# Altium project CHIP_PRO_v1_0.PrjPcb
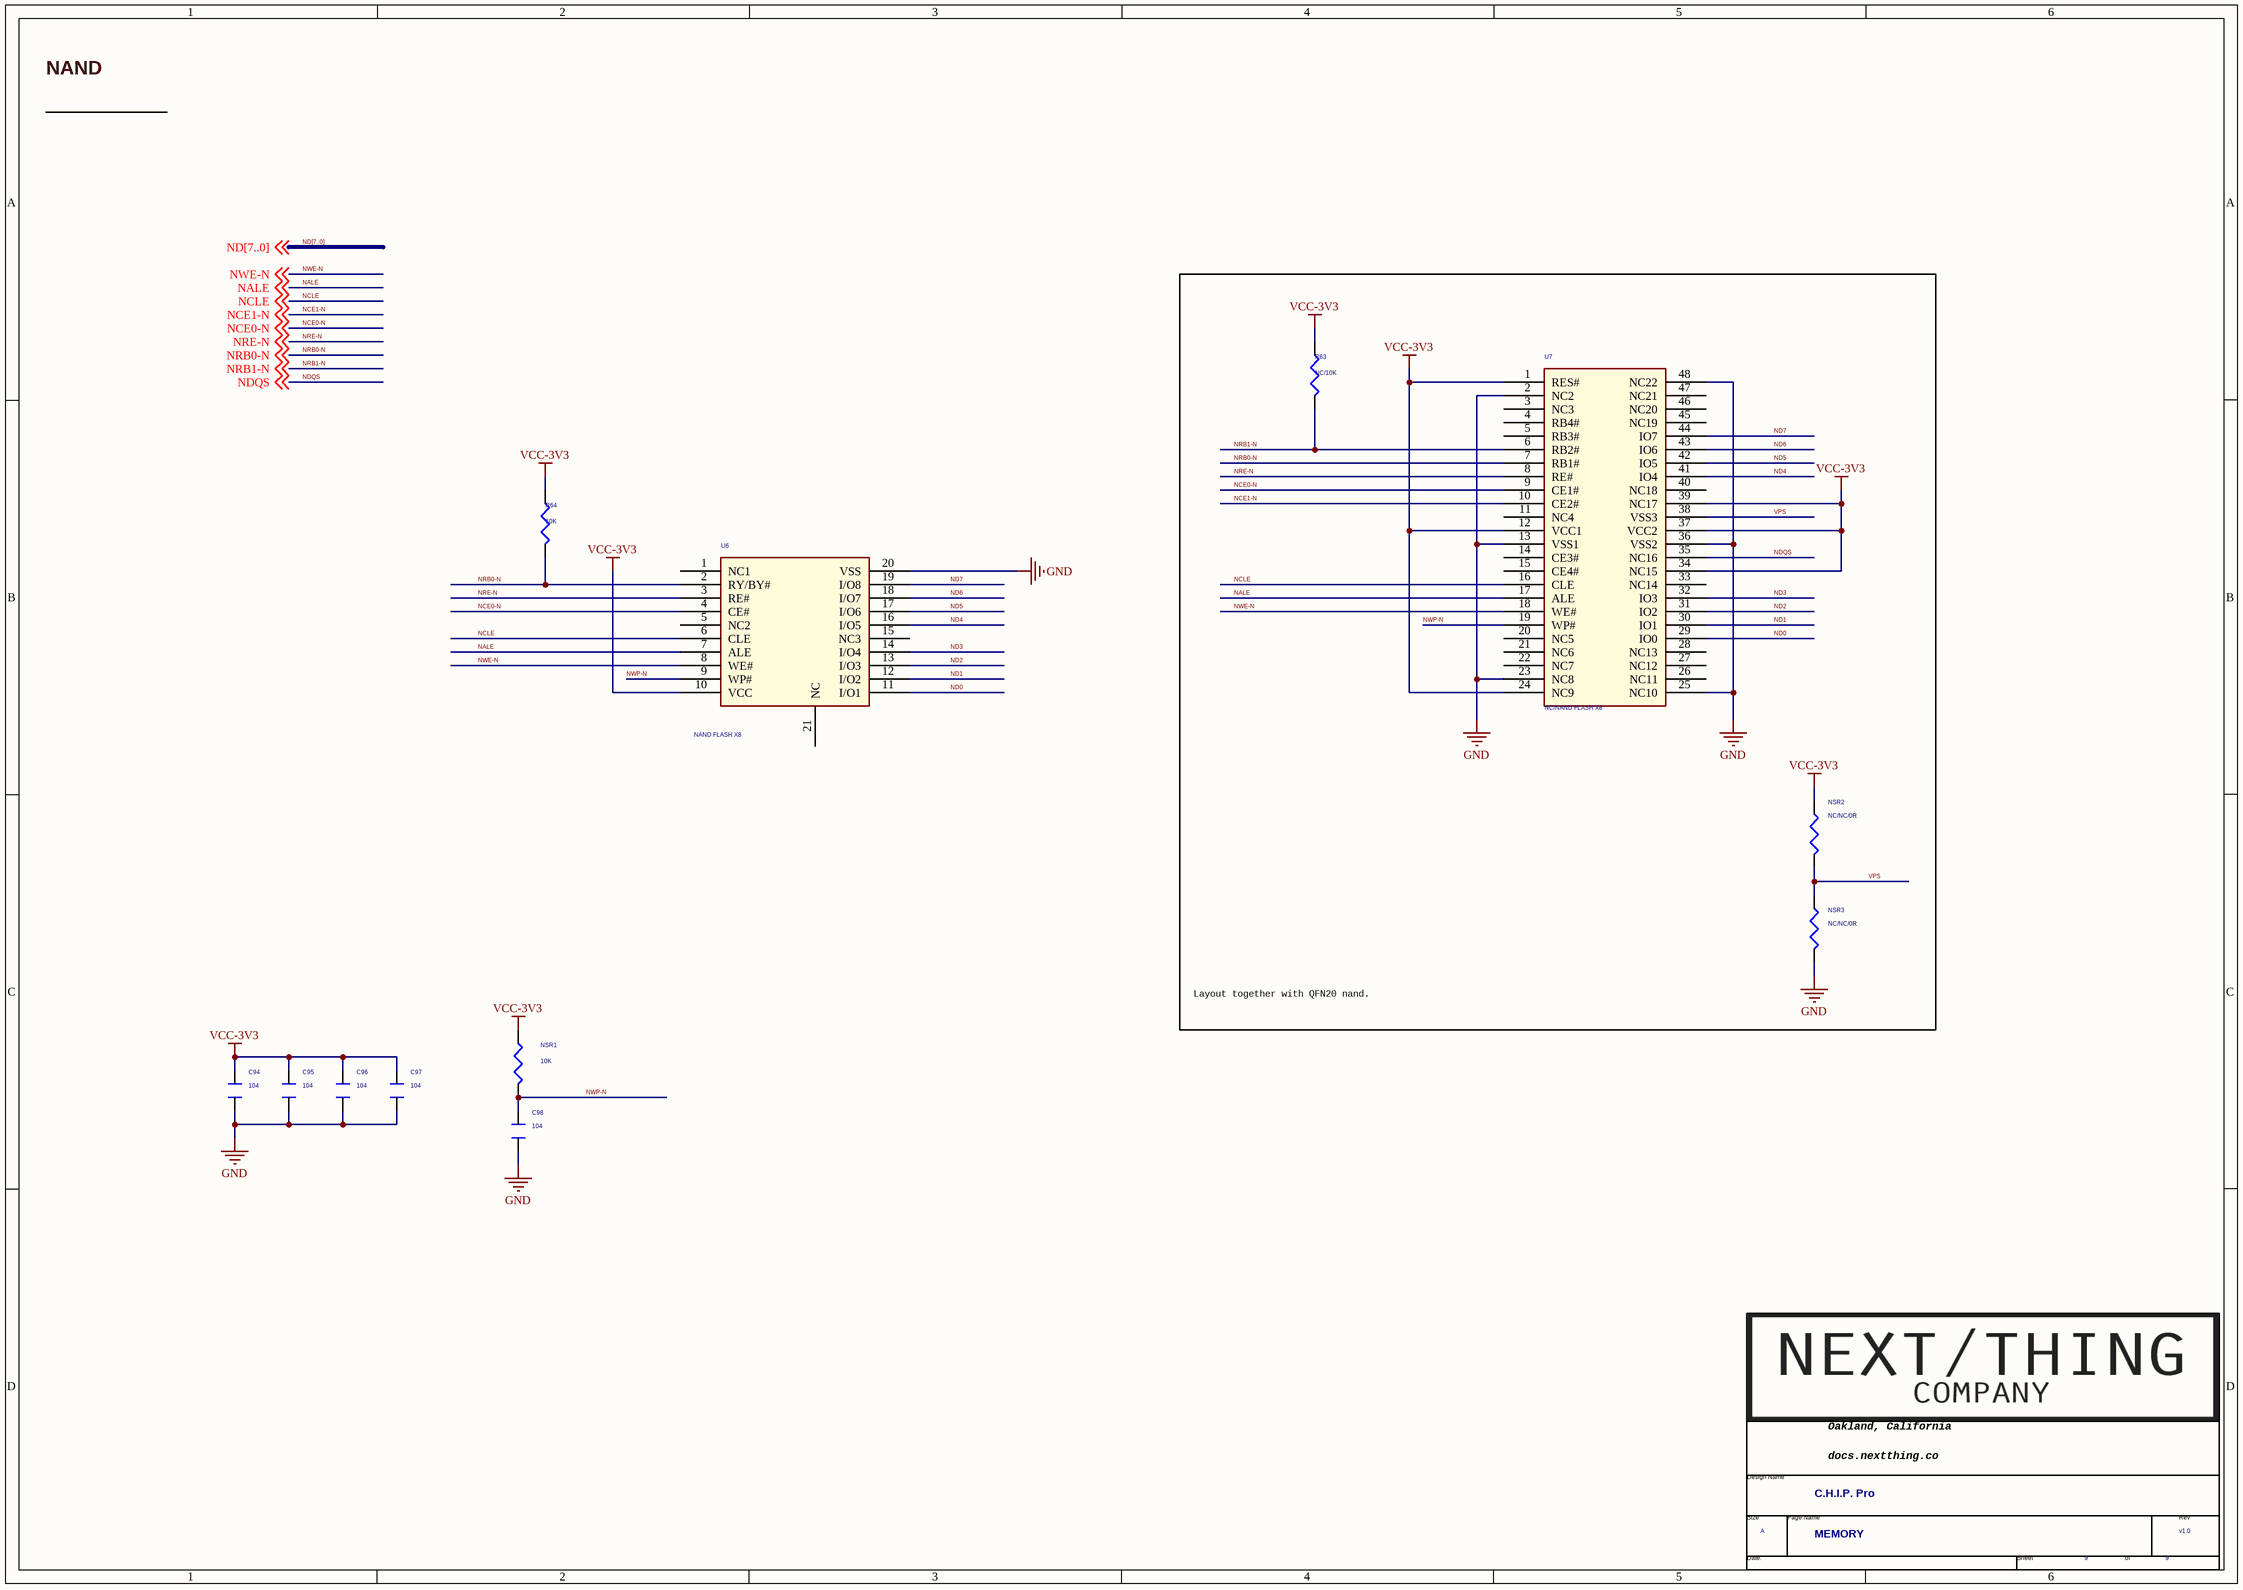
[diagram p0: 09 NAND.SchDoc]
9 sheets, 202 parts. Net scope: global (net labels, ports and power ports of the same name join across sheets).
Sheets:
  09 NAND.SchDoc
  08 BESIDE CPU.SchDoc
  07 USB.SchDoc
  06 SDIO WIFI&BT.SchDoc
  05 MISC.SchDoc
  04 POWER.SchDoc
  03 CPU.SchDoc
  02 BLOCK.SchDoc
  01 REVISION HISTORY.SchDoc

## Sheet 09 NAND.SchDoc
size 420 x 297 mm

### Parts
(Parts that share a designator on the sheet are numbered #1, #2 ... from top to bottom, then left to right.)
*#1  Page Count: 9  Page Size: A  Title: C.H.I.P. Pro  RevCode: v1.0  Doc: MEMORY  (hidden comment: TitleBlock1-nextthing)  (graphical)
C94  104  [C0201]
C95  104  [C0201]
C96  104  [C0201]
C97  104  [C0201]
C98  104  [C0201]
NSR1  10K  [R0201]
NSR2  NC/NC/0R  [R0201]
NSR3  NC/NC/0R  [R0201]
R63  NC/10K  [R0201]
R64  10K  [R0201]
U6  NAND FLASH X8  [TSOP-48]
U7  NC/NAND FLASH X8  [TSOP-48]

### Blocks framed on the sheet
Layout together with QFN20 nand.: NSR2 NSR3 R63 U7

### Nets
GND: C94.1 C95.1 C96.1 C97.1 C98.1 NSR3.2 U6.20(VSS) U7.2(NC2) U7.13(VSS1) U7.23(NC8) U7.25(NC10) U7.36(VSS2) U7.48(NC22)
VCC-3V3: C94.2 C95.2 C96.2 C97.2 NSR1.1 NSR2.1 R63.1 R64.1 U6.10(VCC) U7.1(RES#) U7.12(VCC1) U7.24(NC9) U7.34(NC15) U7.37(VCC2) U7.39(NC17)  [project net HPVCC]
NALE: U6.7(ALE) U7.17(ALE) ; off-sheet NALE
NCE0-N: U6.4(CE#) U7.9(CE1#) ; off-sheet NCE0-N
NCE1-N: U7.10(CE2#) ; off-sheet NCE1-N
NCLE: U6.6(CLE) U7.16(CLE) ; off-sheet NCLE
ND0: U6.11(I/O1) U7.29(IO0)
ND1: U6.12(I/O2) U7.30(IO1)
ND2: U6.13(I/O3) U7.31(IO2)
ND3: U6.14(I/O4) U7.32(IO3)
ND4: U6.16(I/O5) U7.41(IO4)
ND5: U6.17(I/O6) U7.42(IO5)
ND6: U6.18(I/O7) U7.43(IO6)
ND7: U6.19(I/O8) U7.44(IO7)
NDQS: U7.35(NC16) ; off-sheet NDQS
NRB0-N: R64.2 U6.2(RY/BY#) U7.7(RB1#) ; off-sheet NRB0-N
NRB1-N: R63.2 U7.6(RB2#) ; off-sheet NRB1-N
NRE-N: U6.3(RE#) U7.8(RE#) ; off-sheet NRE-N
NWE-N: U6.8(WE#) U7.18(WE#) ; off-sheet NWE-N
NWP-N: C98.2 NSR1.2 U6.9(WP#) U7.19(WP#)
VPS: NSR2.2 NSR3.1 U7.38(VSS3)

Not connected (* = marked no-connect by the designer): U6 1(NC1) 5(NC2) 15(NC3) 21(NC); U7 3(NC3) 4(RB4#) 5(RB3#) 11(NC4) 14(CE3#) 15(CE4#) 20(NC5) 21(NC6) 22(NC7) 26(NC11) 27(NC12) 28(NC13) 33(NC14) 40(NC18) 45(NC19) 46(NC20) 47(NC21)

### Buses and harness runs
bus ND[7..0]

### Notes on the sheet
- NAND
- (in symbol TitleBlock1-nextthing) Oakland, California; Design Name; docs.nextthing.co /; Size; Page Name; Rev; Date:; Sheet; of

### Library data of the parts
C94-C98 = CAPACITOR_0_Dup4: PAGE: 2
NSR1-NSR3 R63 R64 = R_Dup2
  R64: Value: 10K
U6 = NAND_QFN20_1
U7 = NAND_FLASH_X8
*#1 = TitleBlock1-nextthing: Page Number: 9; Page Create Date: March  8, 1995

## Sheet 08 BESIDE CPU.SchDoc
size 420 x 297 mm
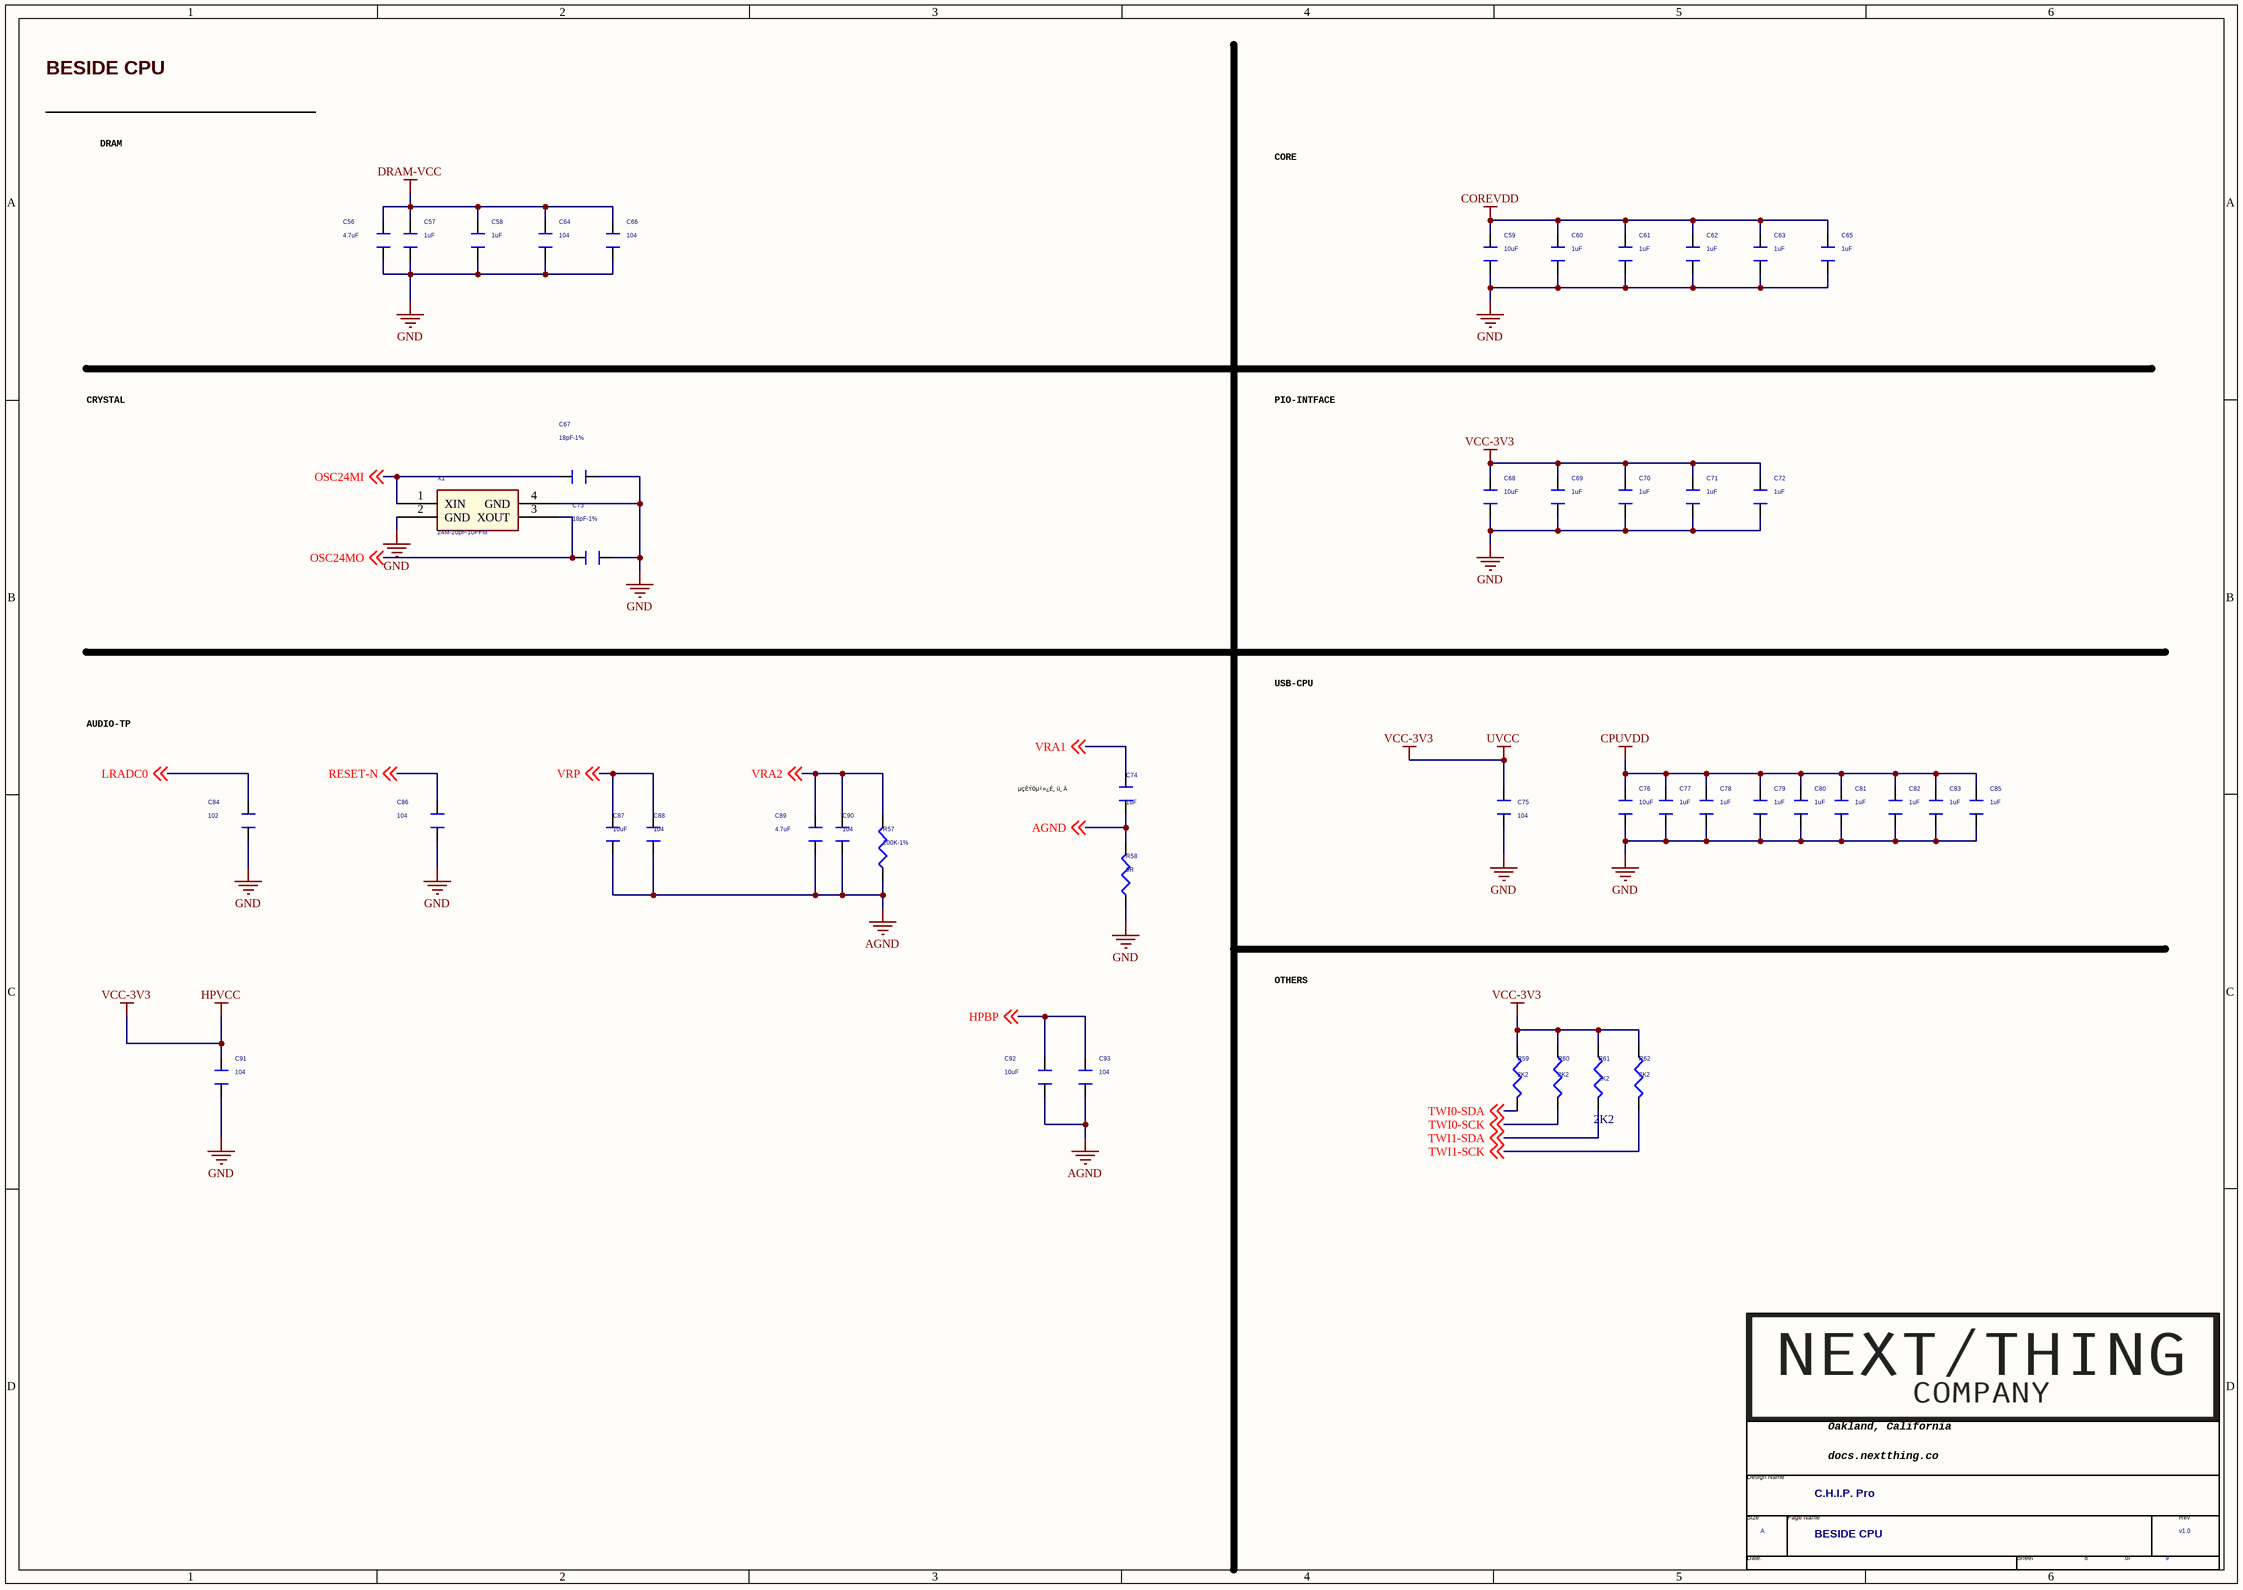
[diagram p1: 08 BESIDE CPU.SchDoc]

### Parts
(Parts that share a designator on the sheet are numbered #1, #2 ... from top to bottom, then left to right.)
*#2  Page Count: 9  Page Number: 8  Page Size: A  Title: C.H.I.P. Pro  RevCode: v1.0  Doc: BESIDE CPU  (hidden comment: TitleBlock1-nextthing)  (graphical)
C56  4.7uF  [C0603]
C57  1uF  [C0402]
C58  1uF  [C0402]
C59  10uF  [C0603]
C60  1uF  [C0402]
C61  1uF  [C0402]
C62  1uF  [C0402]
C63  1uF  [C0402]
C64  104  [C0201]
C65  1uF  [C0402]
C66  104  [C0201]
C67  18pF-1%  [C0201]
C68  10uF  [C0603]
C69  1uF  [C0402]
C70  1uF  [C0402]
C71  1uF  [C0402]
C72  1uF  [C0402]
C73  18pF-1%  [C0201]
C74  1uF  [C0402]
C75  104  [C0201]
C76  10uF  [C0603]
C77  1uF  [C0402]
C78  1uF  [C0402]
C79  1uF  [C0402]
C80  1uF  [C0402]
C81  1uF  [C0402]
C82  1uF  [C0402]
C83  1uF  [C0402]
C84  102  [C0201]
C85  1uF  [C0402]
C86  104  [C0201]
C87  10uF  [C0603]
C88  104  [C0201]
C89  4.7uF  [C0603]
C90  104  [C0201]
C91  104  [C0201]
C92  10uF  [C0603]
C93  104  [C0201]
R57  200K-1%  [R0201]
R58  0R  [R0201]
R59  2K2  [R0201]
R60  2K2  [R0201]
R61  2K2  [R0201]
R62  2K2  [R0201]
X1  24M-20pF-10PPM  [CRY-3225]

### Nets
AGND: C74.1 C87.1 C88.1 C89.1 C90.1 C92.1 C93.1 R57.1 R58.2 ; off-sheet AGND
COREVDD: C59.1 C60.1 C61.1 C62.1 C63.1 C65.1  [project net CORE-VDD]
CPUVDD: C76.1 C77.1 C78.1 C79.1 C80.1 C81.1 C82.1 C83.1 C85.1  [project net CPU-VDD]
DRAM-VCC: C56.2 C57.2 C58.2 C64.2 C66.2
GND: C56.1 C57.1 C58.1 C59.2 C60.2 C61.2 C62.2 C63.2 C64.1 C65.2 C66.1 C67.1 C68.2 C69.1 C70.1 C71.1 C72.1 C73.1 C75.1 C76.2 C77.2 C78.2 C79.2 C80.2 C81.2 C82.2 C83.2 C84.1 C85.2 C86.1 C91.1 R58.1 X1.2(GND) X1.4(GND)
HPVCC: C68.1 C69.2 C70.2 C71.2 C72.2 C75.2 C91.2 R59.1 R60.1 R61.1 R62.1  [also labelled UVCC, VCC-3V3]
HPBP: C92.2 C93.2 ; off-sheet HPBP
LRADC0: C84.2 ; off-sheet LRADC0
OSC24MI: C67.2 X1.1(XIN) ; off-sheet OSC24MI
OSC24MO: C73.2 X1.3(XOUT) ; off-sheet OSC24MO
RESET-N: C86.2 ; off-sheet RESET-N  [project net RESET]
TWI0-SCK: R60.2 ; off-sheet TWI0-SCK  [project net PB0]
TWI0-SDA: R59.2 ; off-sheet TWI0-SDA  [project net PB1]
TWI1-SCK: R62.2 ; off-sheet TWI1-SCK  [project net PB15]
TWI1-SDA: R61.2 ; off-sheet TWI1-SDA  [project net PB16]
VRA1: C74.2 ; off-sheet VRA1
VRA2: C89.2 C90.2 R57.2 ; off-sheet VRA2
VRP: C87.2 C88.2 ; off-sheet VRP

### Notes on the sheet
- BESIDE CPU
- DRAM
- CORE
- CRYSTAL
- PIO-INTFACE
- AUDIO-TP
- USB-CPU
- µçÈÝÖµ²»¿É¸ü¸Ä
- OTHERS
- (in symbol TitleBlock1-nextthing) Oakland, California; Design Name; docs.nextthing.co /; Size; Page Name; Rev; Date:; Sheet; of

### Library data of the parts
C56-C58 C64 C66 C67 C69-C73 C87 C92 C93 = CAPACITOR_0_Dup4: PAGE: 2
C59-C63 C65 C68 C76-C83 C85 = CAPACITOR_0_Dup3: PAGE: 1
C74 C84 C86 C88-C90 = CAPACITOR_0_Dup4
C75 C91 = CAPACITOR_0_Dup4: PAGE: 3
R57-R62 = R_Dup2
  R61: Value: 2K2
X1 = CRYSTAL-4_3: Crystal 24MHz 20pF 10ppm  -30 to +85; PART NUMBER: 7M24000004; Vendor: TXC; SPREADWIN PN: U3000019A
*#2 = TitleBlock1-nextthing: Page Create Date: March  8, 1995

## Sheet 07 USB.SchDoc
size 420 x 297 mm
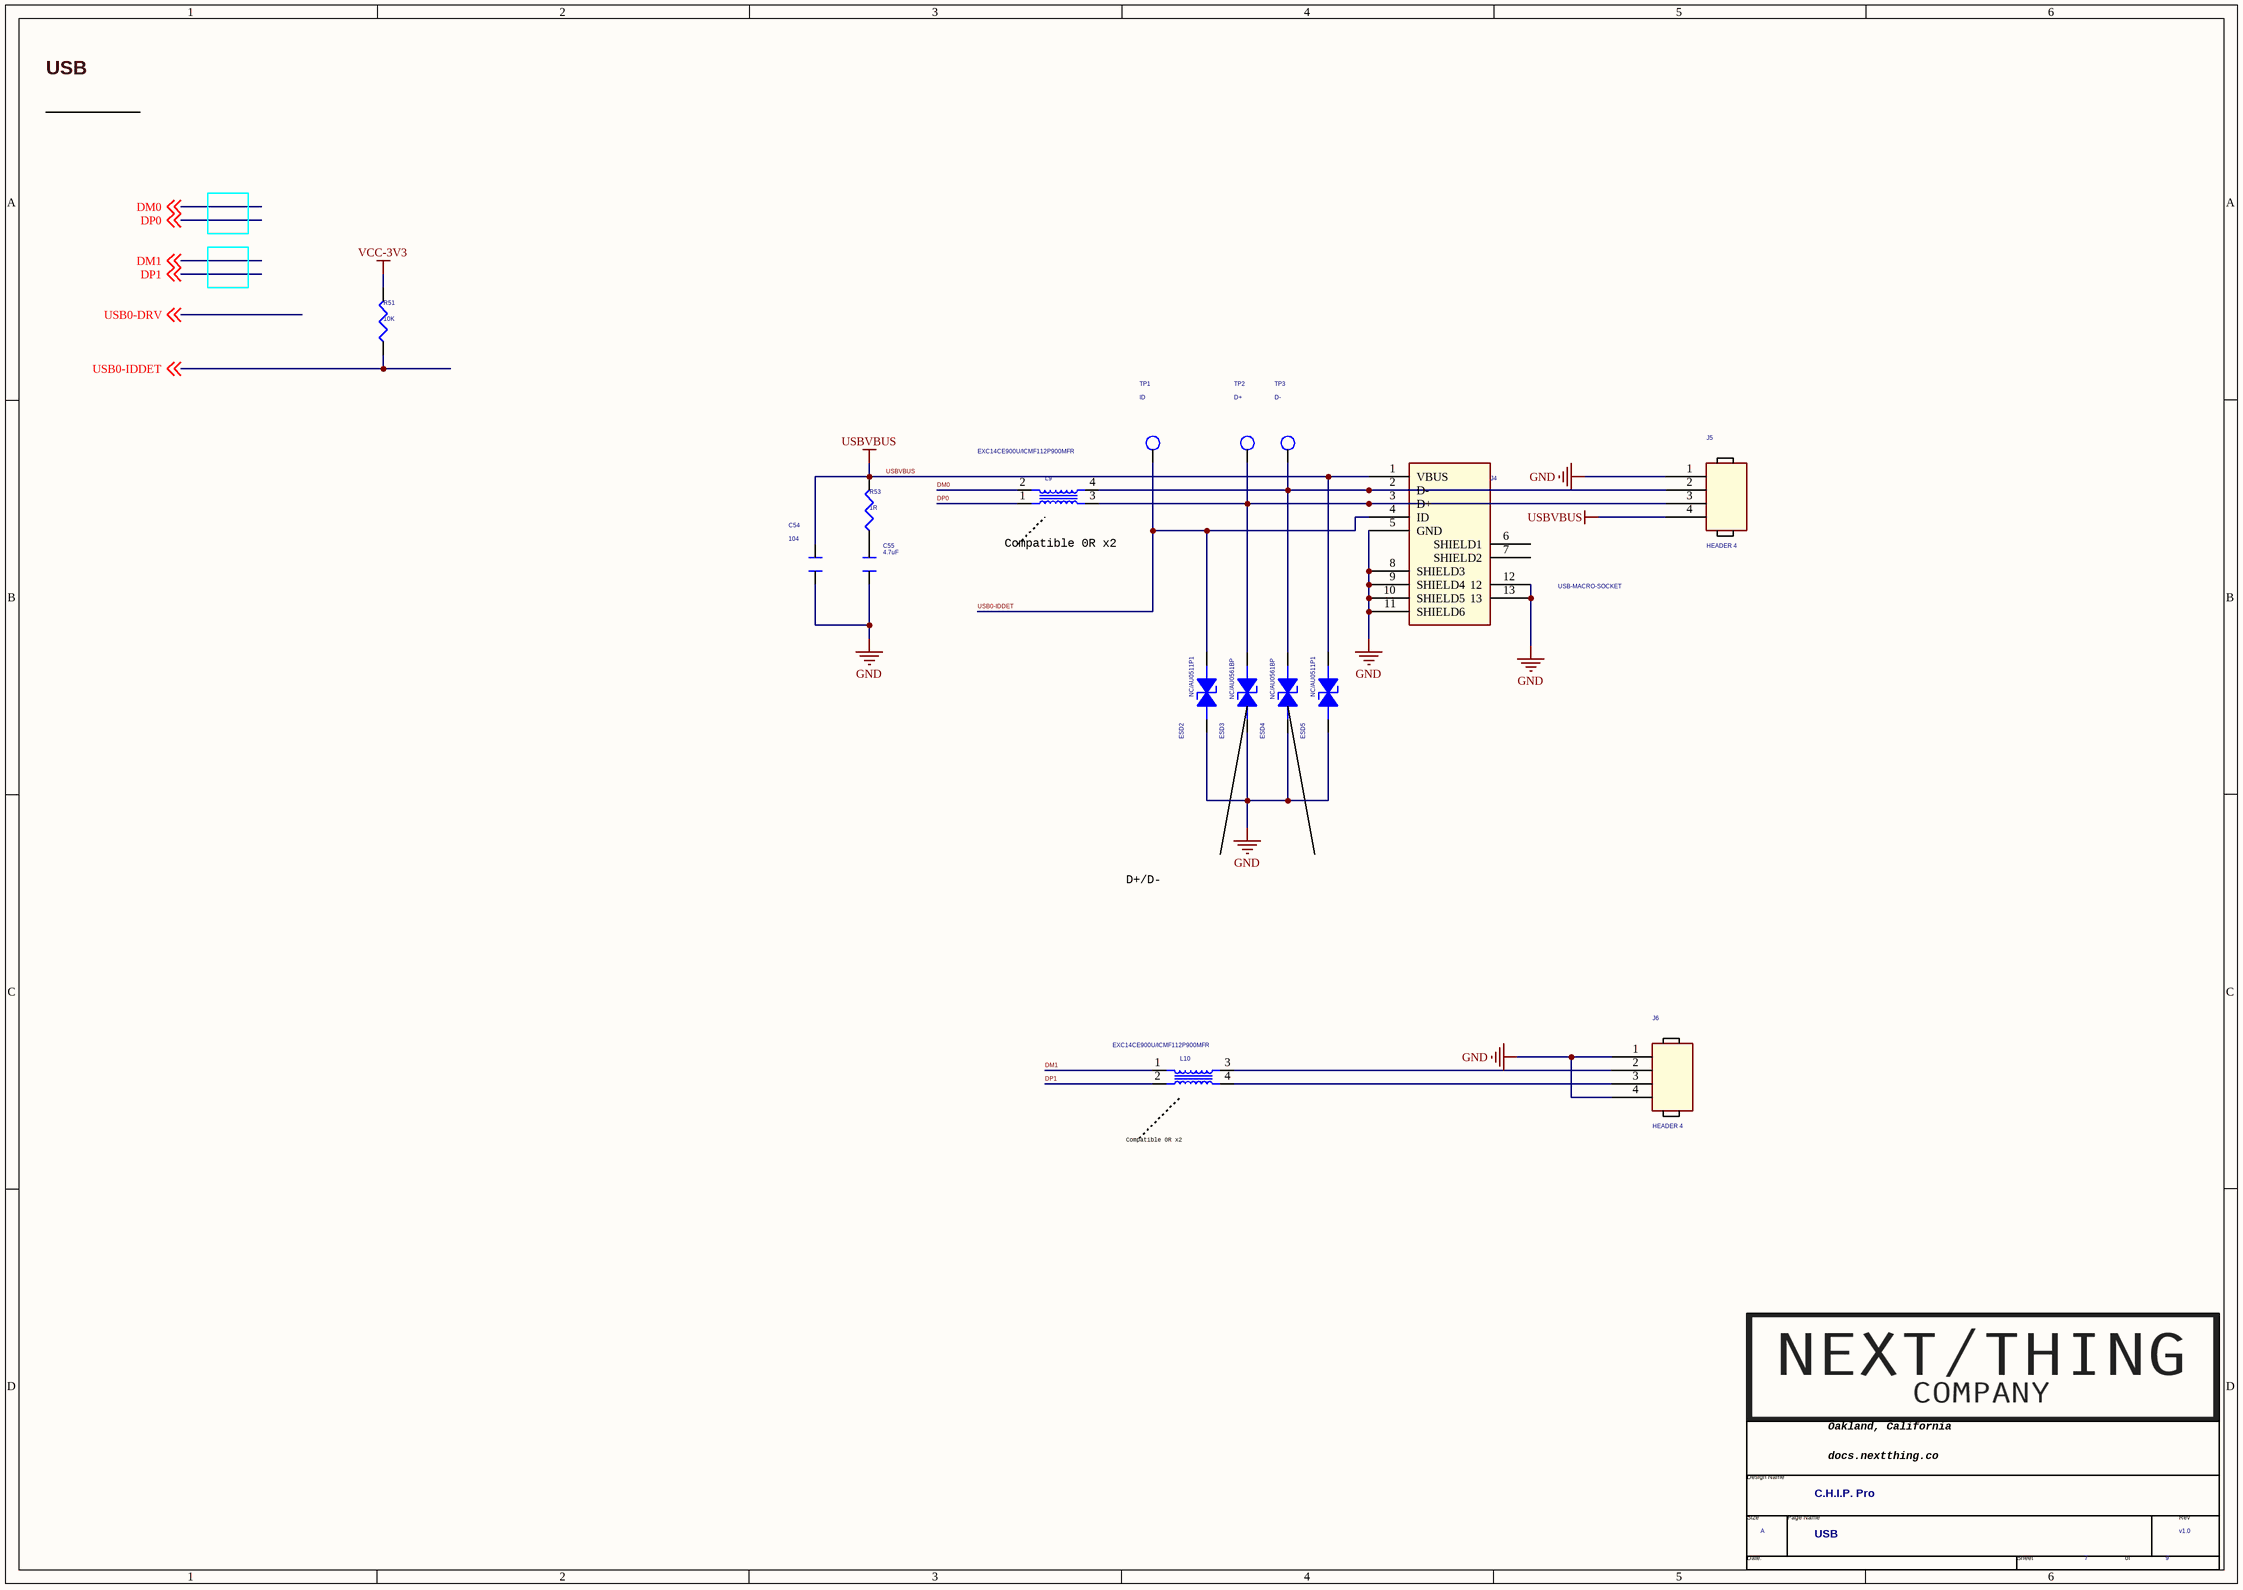
[diagram p2: 07 USB.SchDoc]

### Parts
(Parts that share a designator on the sheet are numbered #1, #2 ... from top to bottom, then left to right.)
*#3  Page Count: 9  Page Number: 7  Page Size: A  Title: C.H.I.P. Pro  RevCode: v1.0  Doc: USB  (hidden comment: TitleBlock1-nextthing)  (graphical)
C54  104  [C0201]
C55  4.7uF  [C0603]
ESD2  NC/AU0511P1  [ESD0402]
ESD3  NC/AU0561BP  [ESD0402]
ESD4  NC/AU0561BP  [ESD0402]
ESD5  NC/AU0511P1  [ESD0402]
J4  USB-MACRO-SOCKET  [USB_MINI_AB]
J5  HEADER 4  [stampvia4]
J6  HEADER 4  [stampvia4]
L9  EXC14CE900U/ICMF112P900MFR  [L0805x2]
L10  EXC14CE900U/ICMF112P900MFR  [L0805x2]
R51  10K  [R0201]
R53  1R  [R0402]
TP1  ID  [tp40_smd]
TP2  D+  [tp40_smd]
TP3  D-  [tp40_smd]

### Nets
GND: C54.1 C55.1 ESD2.2(CATHODE) ESD3.2(CATHODE) ESD4.2(CATHODE) ESD5.2(CATHODE) J4.5(GND) J4.8(SHIELD3) J4.9(SHIELD4) J4.10(SHIELD5) J4.11(SHIELD6) J4.12 J4.13 J5.1 J6.1 J6.4
USBVBUS: C54.2 ESD5.1(ANODE) J4.1(VBUS) J5.4 R53.2
VCC-3V3: R51.2  [project net HPVCC]
DM0: L9.2(R2) ; off-sheet DM0
DM1: L10.1(R1) ; off-sheet DM1
DP0: L9.1(R1) ; off-sheet DP0
DP1: L10.2(R2) ; off-sheet DP1
USB0-IDDET: ESD2.1(ANODE) J4.4(ID) R51.1 TP1.1(TP) ; off-sheet USB0-IDDET  [project net PG2]
NetC55_2: C55.2 R53.1
NetESD3_1: ESD3.1(ANODE) J4.3(D+) J5.3 L9.3(R3) TP2.1(TP)
NetESD4_1: ESD4.1(ANODE) J4.2(D-) J5.2 L9.4(R4) TP3.1(TP)
NetJ6_2: J6.2 L10.3(R3)
NetJ6_3: J6.3 L10.4(R4)

Not connected (* = marked no-connect by the designer): J4 6(SHIELD1) 7(SHIELD2)

### Notes on the sheet
- USB
- (near L9) Compatible 0R x2
- D+/D-
  The parasitic capacitance of esd on D+/D- < 4pf
- Compatible 0R x2
- (in symbol TitleBlock1-nextthing) Oakland, California; Design Name; docs.nextthing.co /; Size; Page Name; Rev; Date:; Sheet; of

### Library data of the parts
C54 = CAPACITOR: Value: 100nF
C55 = CAPACITOR: Value: 4.7uF
ESD2-ESD5 = 1_1.5KE100A: 1ST PART DESCRIPTION: WILL ESD9B5V Bidirection ESD Protection
J4 = USB_MINI_SOCKET_2
L9 L10 = R-PACK4_0
R51 R53 = R_Dup2
TP1-TP3 = T_POINT_R
*#3 = TitleBlock1-nextthing: Page Create Date: March  8, 1995

## Sheet 06 SDIO WIFI&BT.SchDoc
size 420 x 297 mm
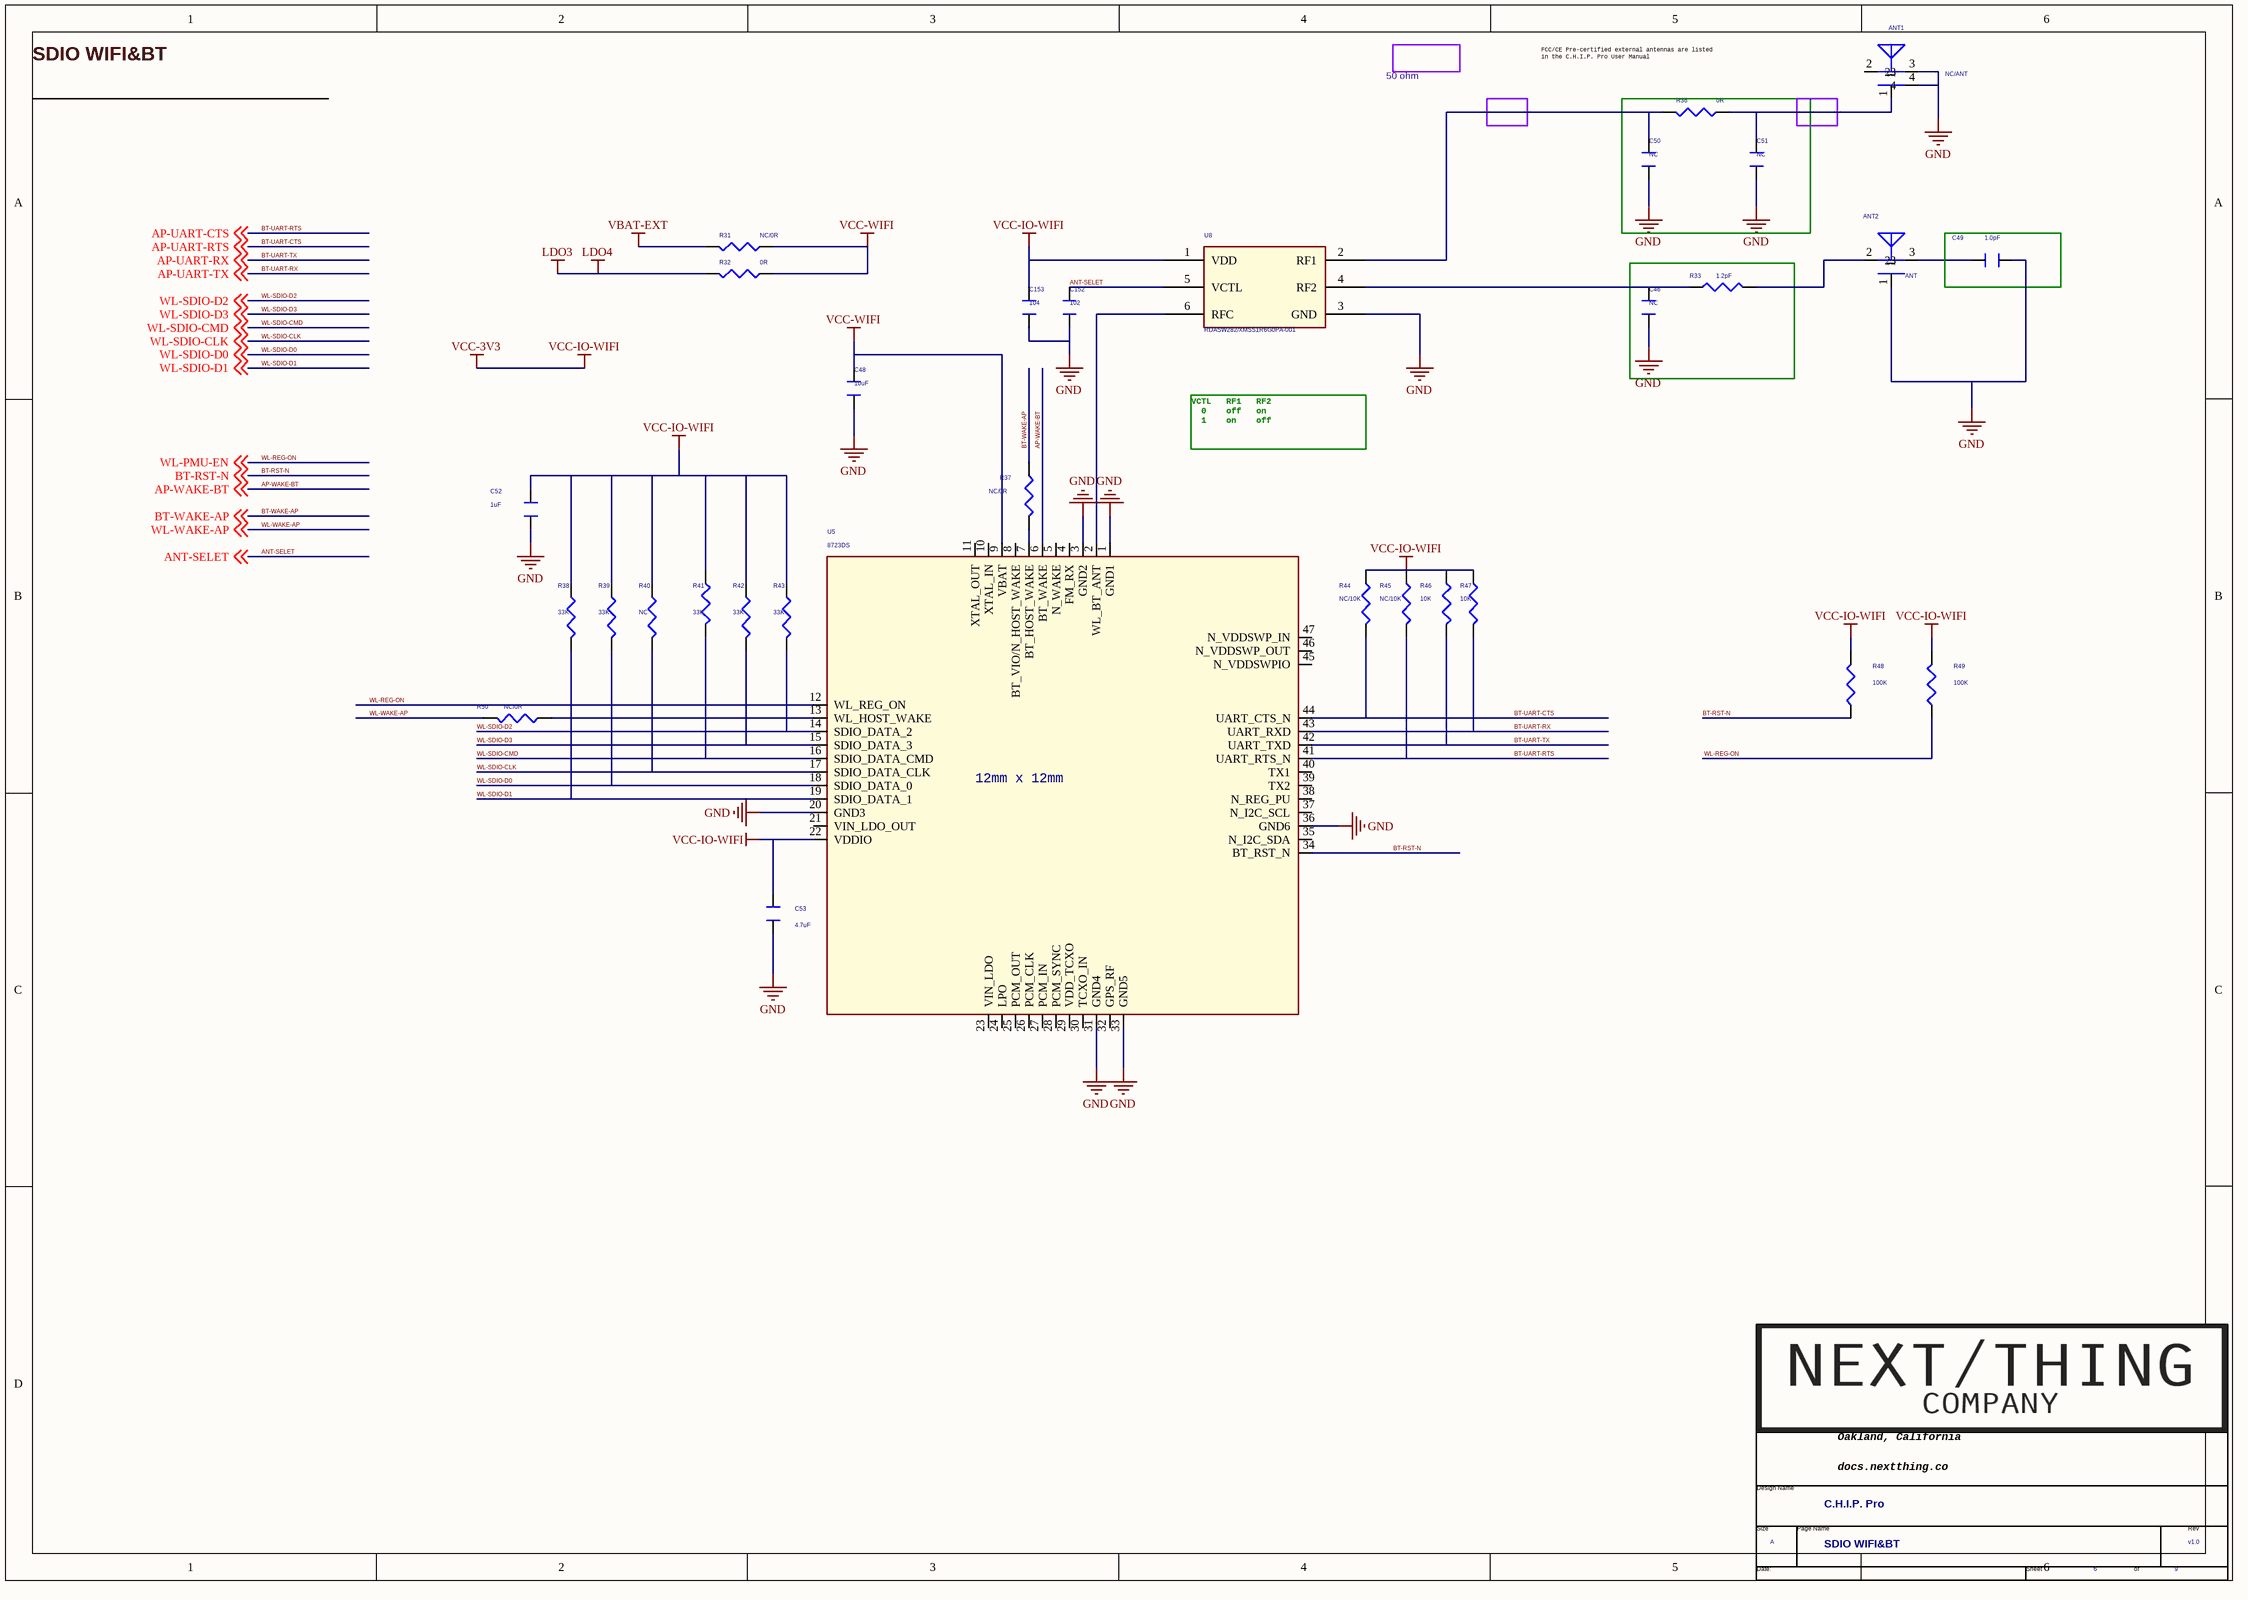
[diagram p3: 06 SDIO WIFI&BT.SchDoc]

### Parts
(Parts that share a designator on the sheet are numbered #1, #2 ... from top to bottom, then left to right.)
*#4  Page Count: 9  Page Number: 6  Page Size: A  Title: C.H.I.P. Pro  RevCode: v1.0  Doc: SDIO WIFI&BT  (hidden comment: TitleBlock1-nextthing)  (graphical)
ANT1  NC/ANT  [WIFI-ANT-SD73412-011H1_3A]
ANT2  ANT  [AA055]
C46  NC  [C0201]
C48  10uF  [C0603]
C49  1.0pF  [C0201]
C50  NC  [C0201]
C51  NC  [C0201]
C52  1uF  [C0402]
C53  4.7uF  [C0603]
C152  102  [C0201]
C153  104  [C0201]
R31  NC/0R  [R0402]
R32  0R  [R0402]
R33  1.2pF  [R0201]
R36  0R  [R0201]
R37  NC/0R  [R0201]
R38  33K  [R0201]
R39  33K  [R0201]
R40  NC  [R0201]
R41  33K  [R0201]
R42  33K  [R0201]
R43  33K  [R0201]
R44  NC/10K  [R0201]
R45  NC/10K  [R0201]
R46  10K  [R0201]
R47  10K  [R0201]
R48  100K  [R0201]
R49  100K  [R0201]
R50  NC/0R  [R0201]
U5  8723DS  [QFN44-AP6476-12X12H1_6A]
U8  RDASW282/XMSS1R6G0PA-001  [RFSW6B105_105H40]

### Nets
GND: ANT1.3 ANT1.4 ANT2.1 C46.2 C48.1 C49.2 C50.2 C51.2 C52.1 C53.2 C152.1 C153.1 U5.1(GND1) U5.3(GND2) U5.20(GND3) U5.31(GND4) U5.33(GND5) U5.36(GND6) U8.3(GND)
LDO3: R32.2  [also labelled LDO4]
VBAT-EXT: R31.2
VCC-3V3: C52.2 C53.1 C153.2 R38.1 R39.1 R40.1 R41.1 R42.1 R43.1 R44.1 R45.1 R46.1 R47.1 R48.2 R49.2 U5.22(VDDIO) U8.1(VDD)  [also labelled VCC-IO-WIFI]  [project net HPVCC]
VCC-WIFI: C48.2 R31.1 R32.1 U5.9(VBAT)
ANT-SELET: C152.2 U8.5(VCTL) ; off-sheet ANT-SELET
AP-WAKE-BT: U5.6(BT_WAKE) ; off-sheet AP-WAKE-BT
BT-RST-N: R48.1 U5.34(BT_RST_N) ; off-sheet BT-RST-N
BT-UART-CTS: R44.2 U5.44(UART_CTS_N) ; off-sheet AP-UART-RTS  [also labelled AP-UART-RTS]
BT-UART-RTS: R45.2 U5.41(UART_RTS_N) ; off-sheet AP-UART-CTS  [also labelled AP-UART-CTS]
BT-UART-RX: R47.2 U5.43(UART_RXD) ; off-sheet AP-UART-TX  [also labelled AP-UART-TX]
BT-UART-TX: R46.2 U5.42(UART_TXD) ; off-sheet AP-UART-RX  [also labelled AP-UART-RX]
BT-WAKE-AP: R37.2 ; off-sheet BT-WAKE-AP
WL-PMU-EN: R49.1 U5.12(WL_REG_ON) ; off-sheet WL-PMU-EN  [also labelled WL-REG-ON]  [project net PB10]
WL-SDIO-CLK: R40.2 U5.17(SDIO_DATA_CLK) ; off-sheet WL-SDIO-CLK  [project net PF2]
WL-SDIO-CMD: R41.2 U5.16(SDIO_DATA_CMD) ; off-sheet WL-SDIO-CMD  [project net PF3]
WL-SDIO-D0: R39.2 U5.18(SDIO_DATA_0) ; off-sheet WL-SDIO-D0  [project net PF1]
WL-SDIO-D1: R38.2 U5.19(SDIO_DATA_1) ; off-sheet WL-SDIO-D1  [project net PF0]
WL-SDIO-D2: R43.2 U5.14(SDIO_DATA_2) ; off-sheet WL-SDIO-D2  [project net PF5]
WL-SDIO-D3: R42.2 U5.15(SDIO_DATA_3) ; off-sheet WL-SDIO-D3  [project net PF4]
WL-WAKE-AP: R50.2 ; off-sheet WL-WAKE-AP  [project net PB3]
NetANT1_1: ANT1.1 C51.1 R36.1
NetANT2_2: ANT2.2 R33.2
NetANT2_3: ANT2.3 C49.1
NetC46_1: C46.1 R33.1 U8.4(RF2)
NetC50_1: C50.1 R36.2 U8.2(RF1)
NetR37_1: R37.1 U5.7(BT_HOST_WAKE)
NetR50_1: R50.1 U5.13(WL_HOST_WAKE)
NetU5_2: U5.2(WL_BT_ANT) U8.6(RFC)

Not connected (* = marked no-connect by the designer): ANT1 2; U5 4(FM_RX) 5(N_WAKE) 8(BT_VIO/N_HOST_WAKE) 10(XTAL_IN) 11(XTAL_OUT) 21(VIN_LDO_OUT) 23(VIN_LDO) 24(LPO) 25(PCM_OUT) 26(PCM_CLK) 27(PCM_IN) 28(PCM_SYNC) 29(VDD_TCXO) 30(TCXO_IN) 32(GPS_RF) 35(N_I2C_SDA) 37(N_I2C_SCL) 38(N_REG_PU) 39(TX2) 40(TX1) 45(N_VDDSWPIO) 46(N_VDDSWP_OUT) 47(N_VDDSWP_IN)

### Notes on the sheet
- (near ANT1) FCC/CE Pre-certified external antennas are listed
  in the C.H.I.P. Pro User Manual
- SDIO WIFI&BT
- 50 ohm
- VCTL   RF1   RF2
  0    off   on
  1    on    off
- (in symbol AP6493_4) 12mm x 12mm
- (in symbol TitleBlock1-nextthing) Oakland, California; Design Name; docs.nextthing.co /; Size; Page Name; Rev; Date:; Sheet; of

### Library data of the parts
ANT1 = ANT_4
ANT2 = ANT_2
C46 C48-C53 C152 C153 = CAPACITOR_0_Dup4: PAGE: 2
R31-R33 R36-R50 = R_Dup1
U5 = AP6493_4: Device: AMPAK_SIP; QVL: AMPAK; ORCAD_LIB: MODULE
U8 = SP2T
*#4 = TitleBlock1-nextthing: Page Create Date: March  8, 1995

## Sheet 05 MISC.SchDoc
size 420 x 297 mm
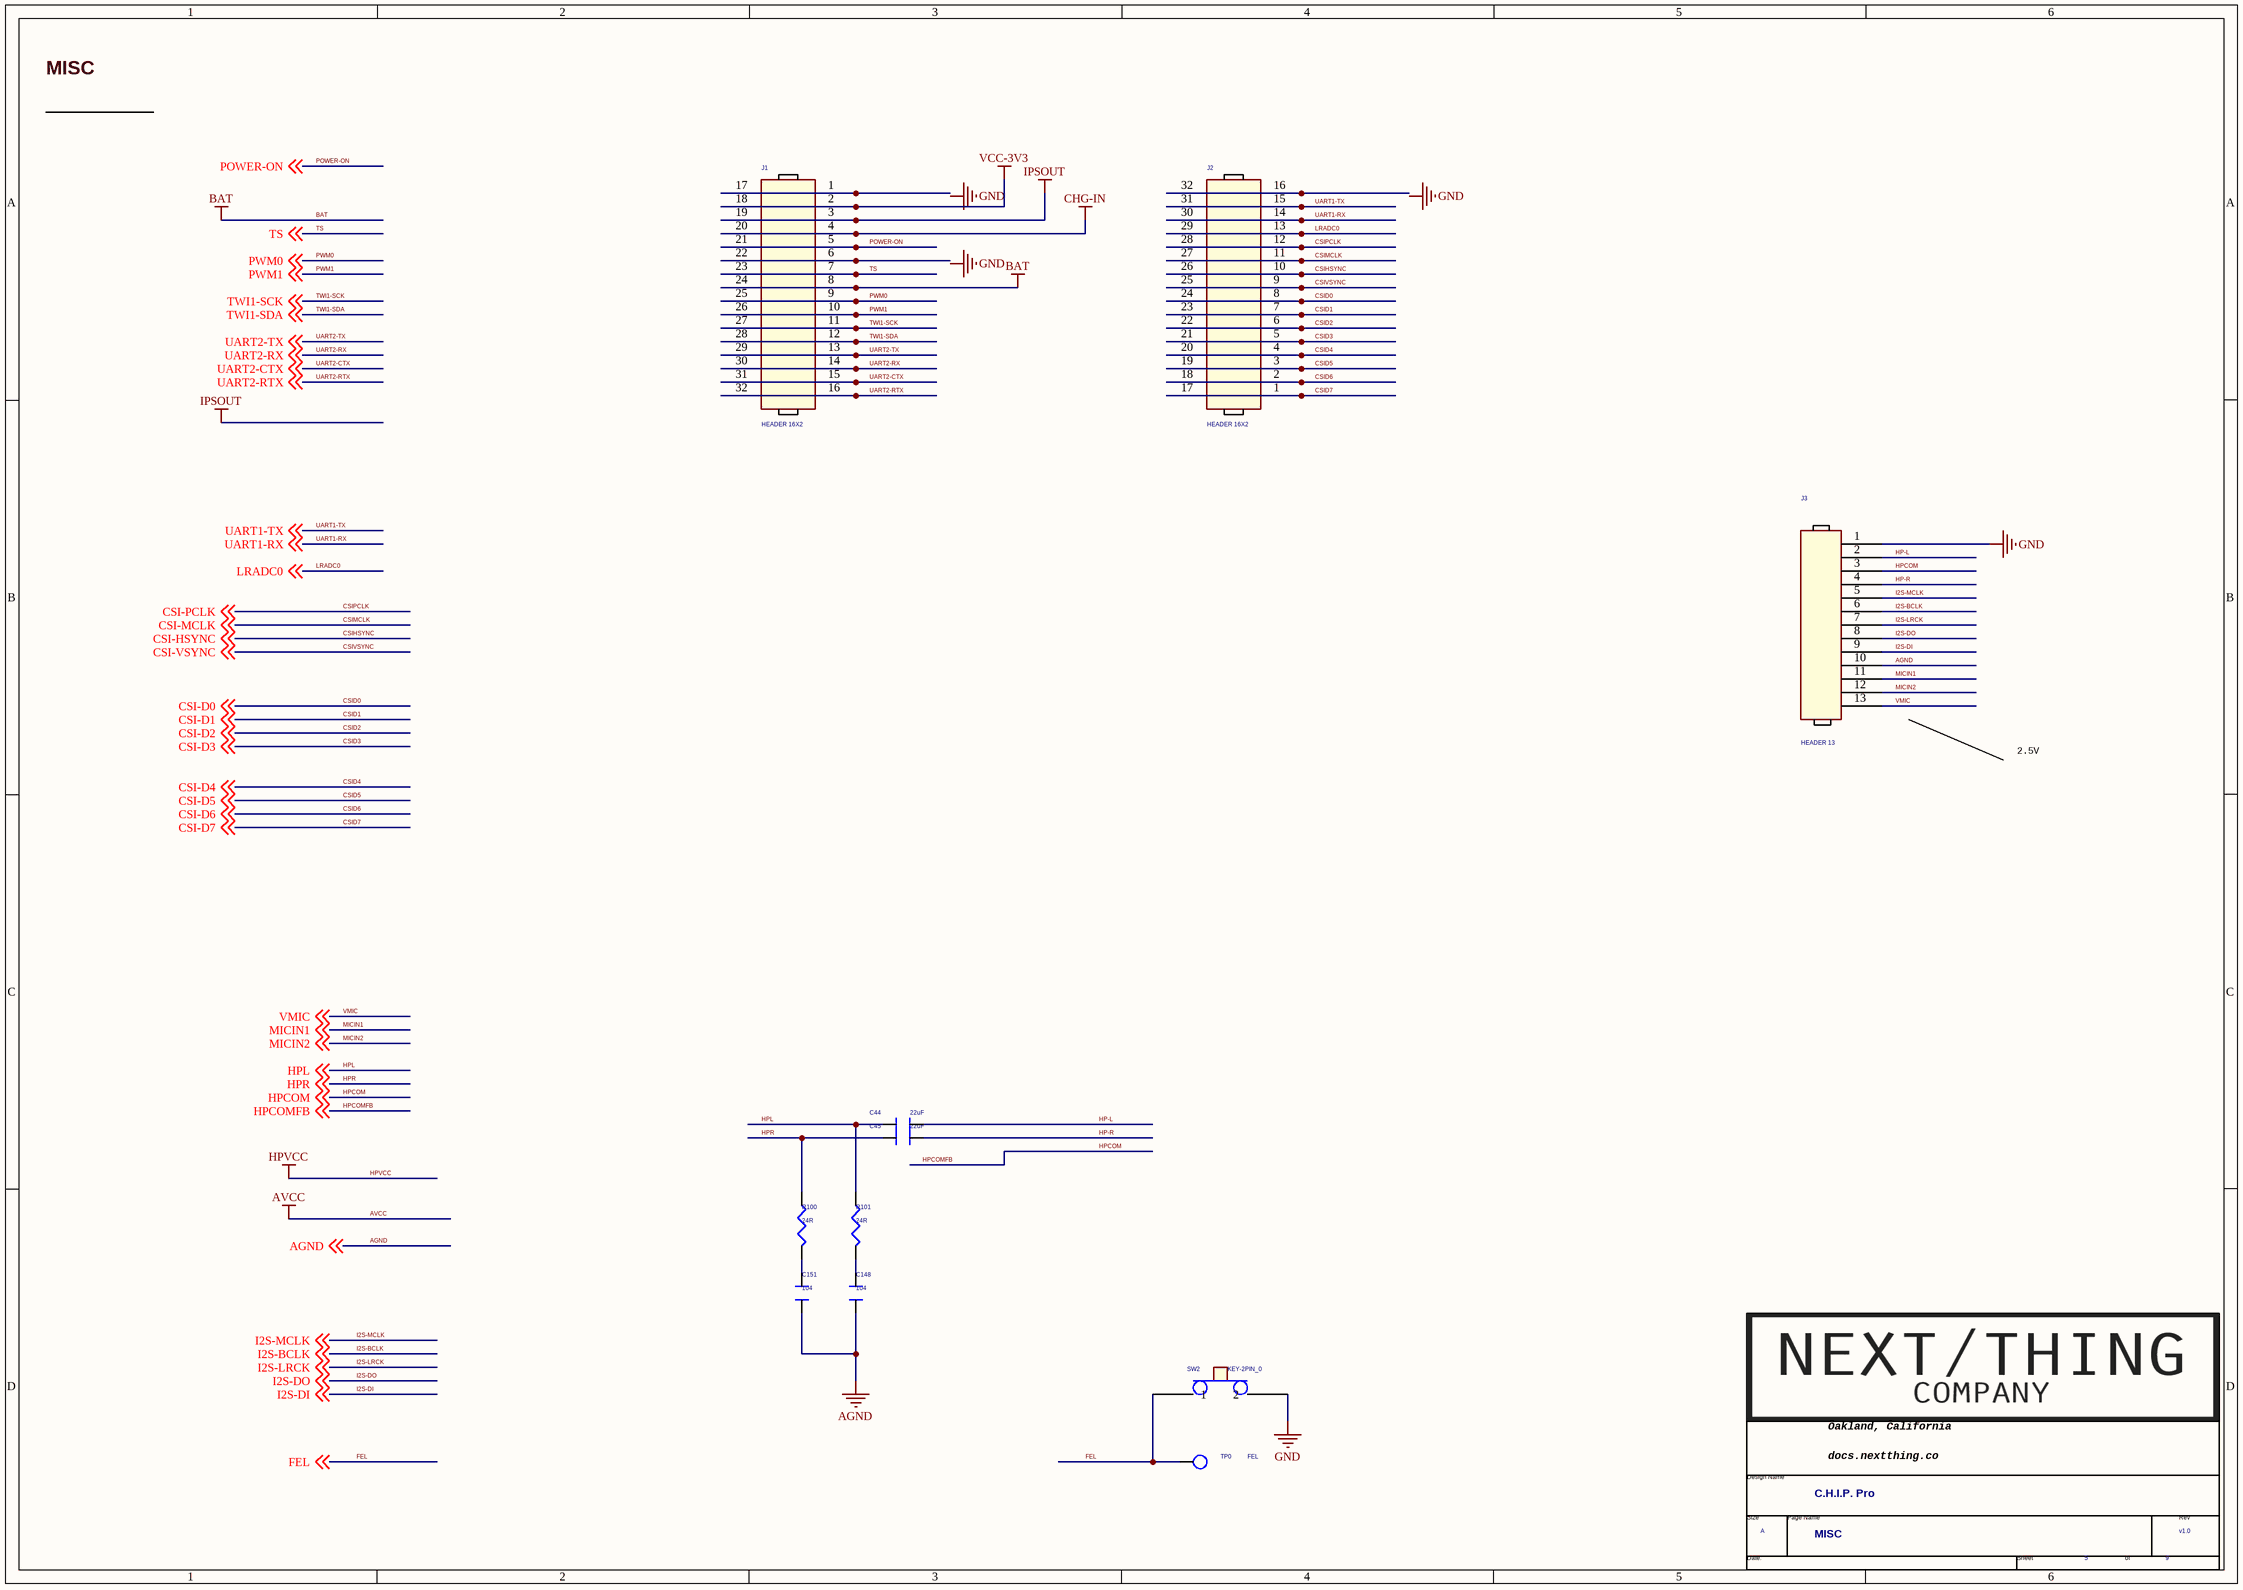
[diagram p4: 05 MISC.SchDoc]

### Parts
(Parts that share a designator on the sheet are numbered #1, #2 ... from top to bottom, then left to right.)
*#5  Page Count: 9  Page Number: 5  Page Size: A  Title: C.H.I.P. Pro  RevCode: v1.0  Doc: MISC  (hidden comment: TitleBlock1-nextthing)  (graphical)
C44  22uF  [C0805]
C45  22uF  [C0805]
C148  104  [C0201]
C151  104  [C0201]
J1  HEADER 16X2  [stampvia16]
J2  HEADER 16X2  [stampvia16]
J3  HEADER 13  [stampvia13]
R100  24R  [R0402]
R101  24R  [R0402]
SW2  KEY-2PIN_0  [KEY-2]
TP0  FEL  [tp40_smd]

### Nets
AGND: C148.2 C151.2 J3.10 ; off-sheet AGND
BAT: J1.8 J1.24
CHG-IN: J1.4 J1.20
GND: J3.1 SW2.2
HPVCC: J1.2 J1.18  [also labelled VCC-3V3]
IPSOUT: J1.3 J1.19
VMIC: J3.13 ; off-sheet VMIC
CSID0: J2.8 J2.24 ; off-sheet CSI-D0  [also labelled CSI-D0]
CSID1: J2.7 J2.23 ; off-sheet CSI-D1  [also labelled CSI-D1]
CSID2: J2.6 J2.22 ; off-sheet CSI-D2  [also labelled CSI-D2]
CSID3: J2.5 J2.21 ; off-sheet CSI-D3  [also labelled CSI-D3]
CSID4: J2.4 J2.20 ; off-sheet CSI-D4  [also labelled CSI-D4]
CSID5: J2.3 J2.19 ; off-sheet CSI-D5  [also labelled CSI-D5]
CSID6: J2.2 J2.18 ; off-sheet CSI-D6  [also labelled CSI-D6]
CSID7: J2.1 J2.17 ; off-sheet CSI-D7  [also labelled CSI-D7]
CSIHSYNC: J2.10 J2.26 ; off-sheet CSI-HSYNC  [also labelled CSI-HSYNC]
CSIMCLK: J2.11 J2.27 ; off-sheet CSI-MCLK  [also labelled CSI-MCLK]
CSIPCLK: J2.12 J2.28 ; off-sheet CSI-PCLK  [also labelled CSI-PCLK]
CSIVSYNC: J2.9 J2.25 ; off-sheet CSI-VSYNC  [also labelled CSI-VSYNC]
FEL: SW2.1 TP0.1(TP) ; off-sheet FEL
HP-L: C44.2 J3.2
HP-R: C45.2 J3.4
HPCOM: J3.3 ; off-sheet HPCOM, off-sheet HPCOMFB  [also labelled HPCOMFB]
HPL: C44.1 R101.1 ; off-sheet HPL
HPR: C45.1 R100.1 ; off-sheet HPR
I2S-BCLK: J3.6 ; off-sheet I2S-BCLK
I2S-DI: J3.9 ; off-sheet I2S-DI
I2S-DO: J3.8 ; off-sheet I2S-DO
I2S-LRCK: J3.7 ; off-sheet I2S-LRCK
I2S-MCLK: J3.5 ; off-sheet I2S-MCLK
LRADC0: J2.13 J2.29 ; off-sheet LRADC0
MICIN1: J3.11 ; off-sheet MICIN1
MICIN2: J3.12 ; off-sheet MICIN2
POWER-ON: J1.5 J1.21 ; off-sheet POWER-ON
PWM0: J1.9 J1.25 ; off-sheet PWM0  [project net PB2]
PWM1: J1.10 J1.26 ; off-sheet PWM1  [project net PG13]
TS: J1.7 J1.23 ; off-sheet TS
TWI1-SCK: J1.11 J1.27 ; off-sheet TWI1-SCK  [project net PB15]
TWI1-SDA: J1.12 J1.28 ; off-sheet TWI1-SDA  [project net PB16]
UART1-RX: J2.14 J2.30 ; off-sheet UART1-RX
UART1-TX: J2.15 J2.31 ; off-sheet UART1-TX  [project net PG3]
UART2-CTX: J1.15 J1.31 ; off-sheet UART2-CTX  [project net PD4]
UART2-RTX: J1.16 J1.32 ; off-sheet UART2-RTX  [project net PD5]
UART2-RX: J1.14 J1.30 ; off-sheet UART2-RX  [project net PD3]
UART2-TX: J1.13 J1.29 ; off-sheet UART2-TX  [project net PD2]
NetC148_1: C148.1 R101.2
NetC151_1: C151.1 R100.2
NetJ1_1: J1.1 J1.17
NetJ1_6: J1.6 J1.22
NetJ2_16: J2.16 J2.32

### Notes on the sheet
- MISC
- 2.5V
- Labels drawn without touching a wire or pin: GND
- (in symbol TitleBlock1-nextthing) Oakland, California; Design Name; docs.nextthing.co /; Size; Page Name; Rev; Date:; Sheet; of

### Library data of the parts
C44 C45 = CAPACITOR_0: PAGE: 1
C148 C151 = CAPACITOR_0_Dup1: PAGE: 1
J1 J2 = HEADER 16X2_0
R100 R101 = ?_0
TP0 = T_POINT_R
*#5 = TitleBlock1-nextthing: Page Create Date: March  8, 1995

## Sheet 04 POWER.SchDoc
size 420 x 297 mm
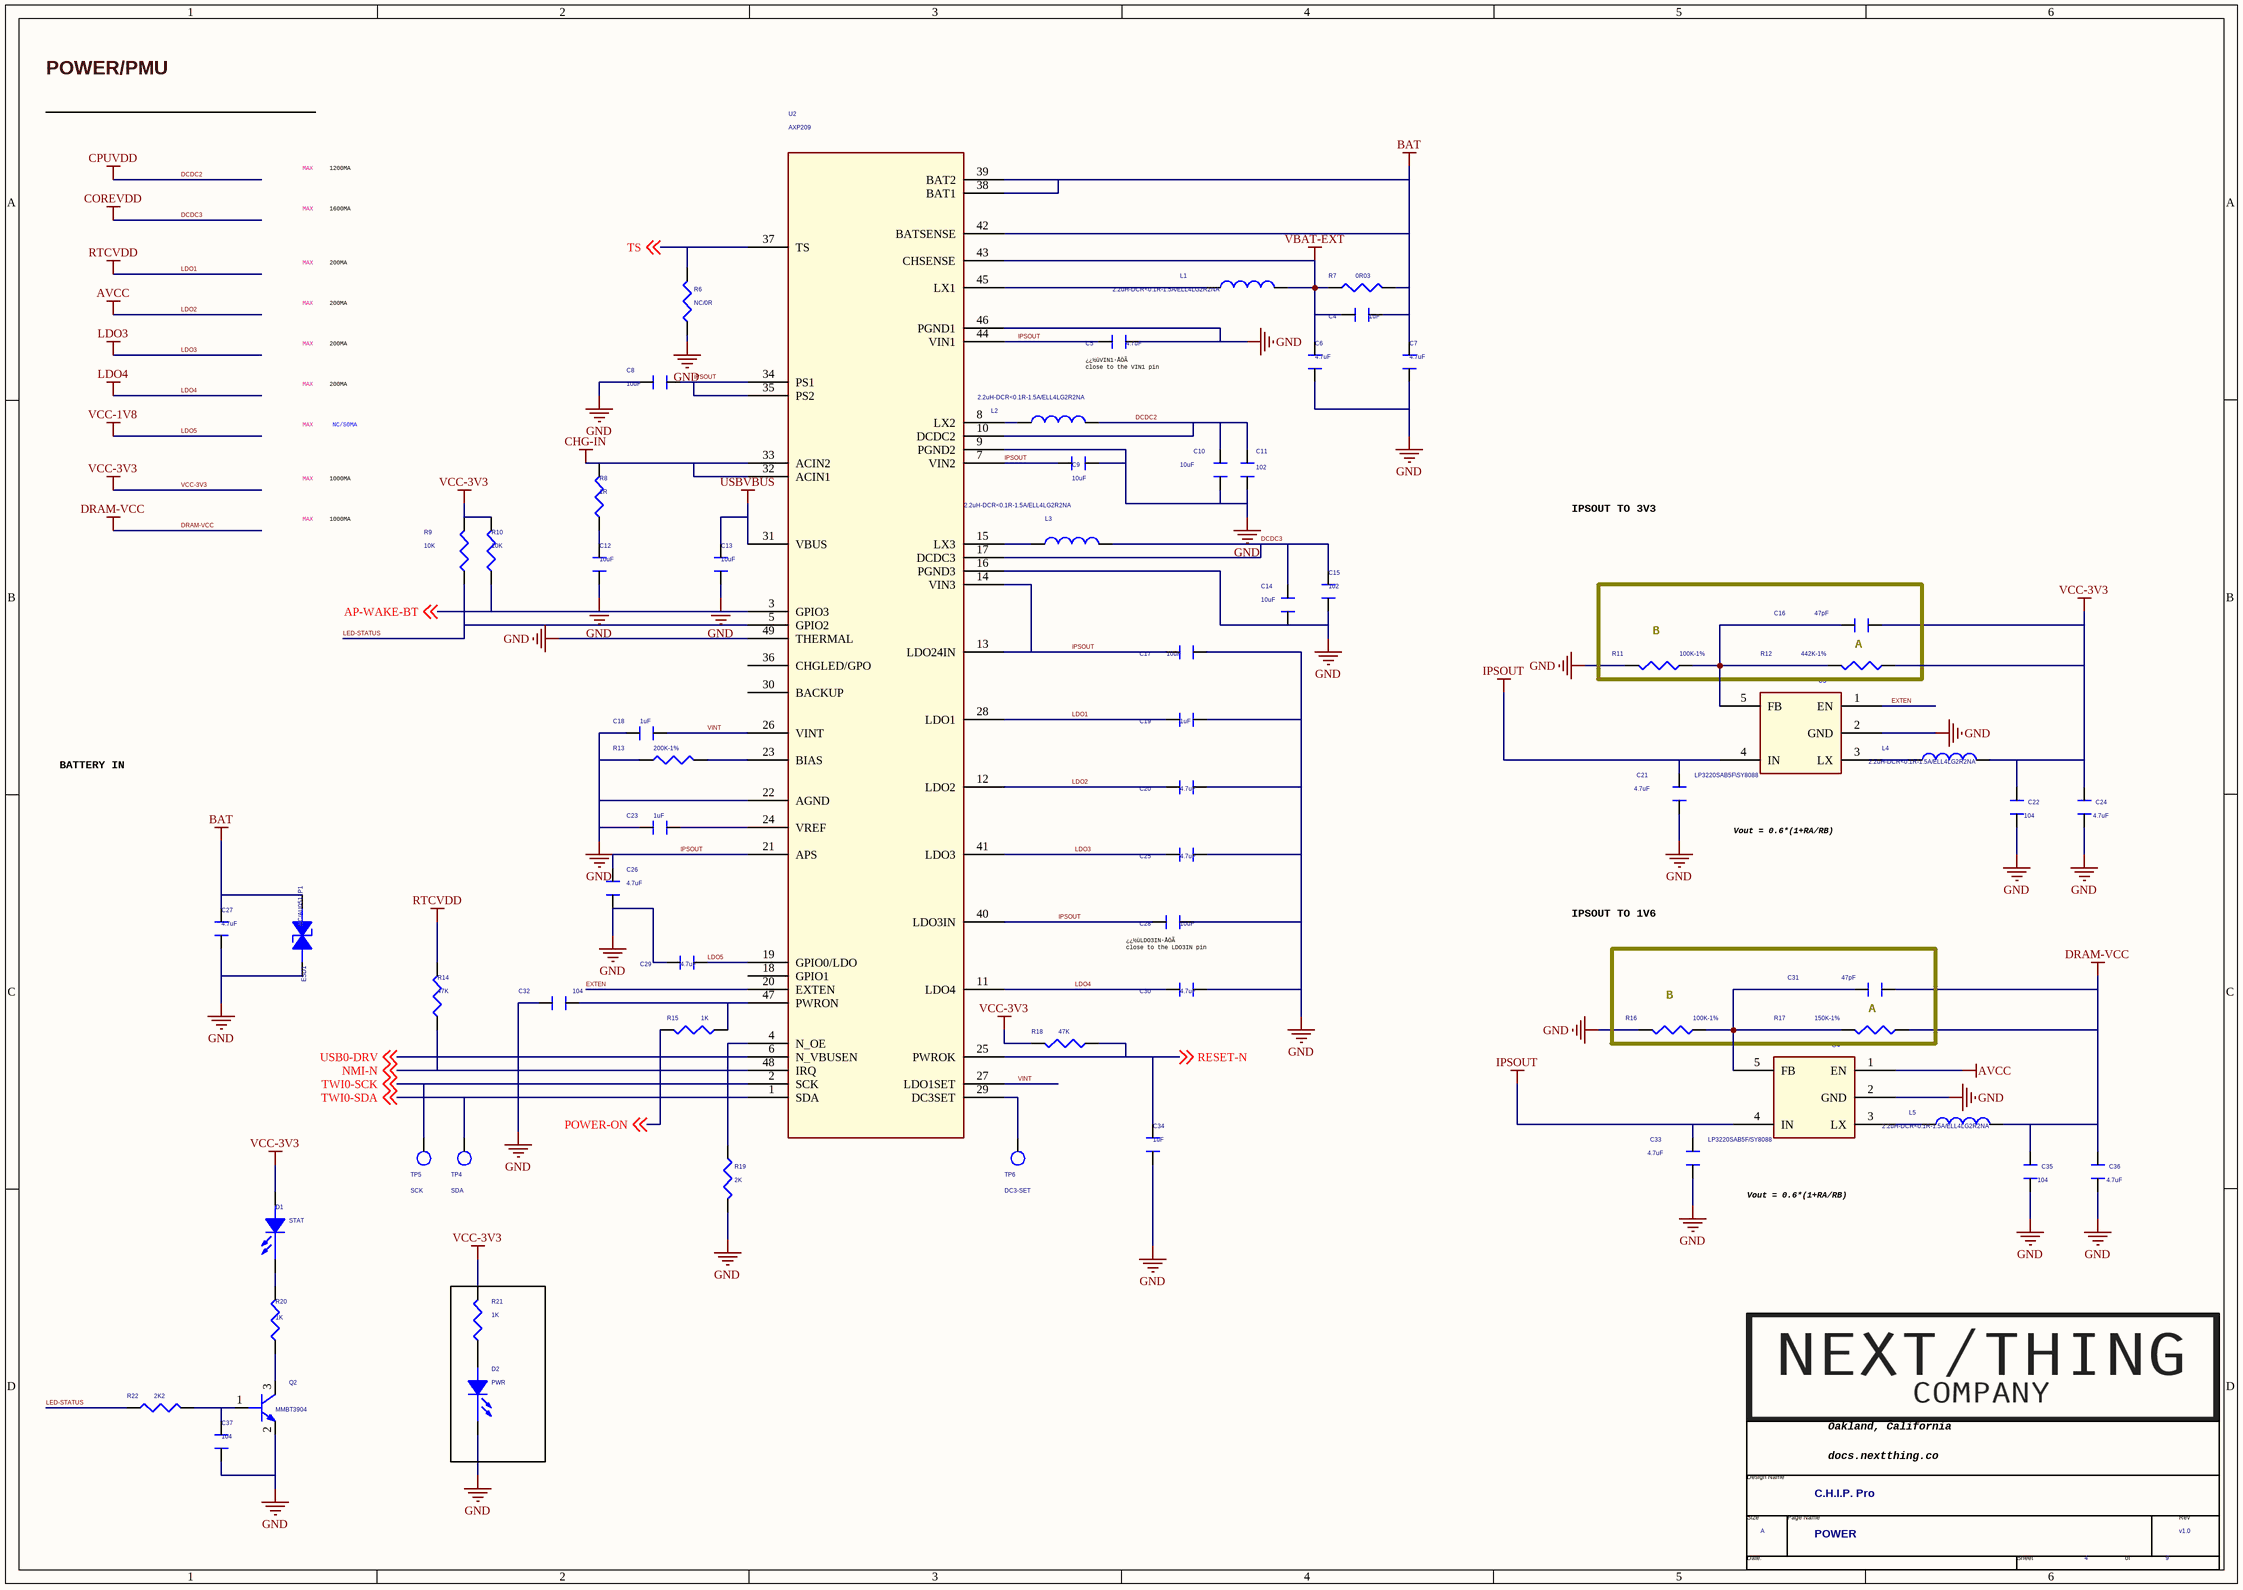
[diagram p5: 04 POWER.SchDoc]

### Parts
(Parts that share a designator on the sheet are numbered #1, #2 ... from top to bottom, then left to right.)
*#6  Page Count: 9  Page Number: 4  Page Size: A  Title: C.H.I.P. Pro  RevCode: v1.0  Doc: POWER  (hidden comment: TitleBlock1-nextthing)  (graphical)
C4  1uF  [C0402]
C5  4.7uF  [C0603]
C6  4.7uF  [C0603]
C7  4.7uF  [C0603]
C8  10uF  [C0603]
C9  10uF  [C0603]
C10  10uF  [C0603]
C11  102  [C0201]
C12  10uF  [C0603]
C13  10uF  [C0603]
C14  10uF  [C0603]
C15  102  [C0201]
C16  47pF  [C0201]
C17  10uF  [C0603]
C18  1uF  [C0402]
C19  1uF  [C0402]
C20  4.7uF  [C0603]
C21  4.7uF  [C0603]
C22  104  [C0201]
C23  1uF  [C0402]
C24  4.7uF  [C0603]
C25  4.7uF  [C0603]
C26  4.7uF  [C0603]
C27  4.7uF  [C0603]
C28  10uF  [C0603]
C29  4.7uF  [C0603]
C30  4.7uF  [C0603]
C31  47pF  [C0201]
C32  104  [C0201]
C33  4.7uF  [C0603]
C34  1uF  [C0402]
C35  104  [C0201]
C36  4.7uF  [C0603]
C37  104  [C0201]
D1  STAT  [D0603]
D2  PWR  [D0603]
ESD1  NC/AU0511P1  [ESD0402]
L1  2.2uH-DCR<0.1R-1.5A/ELL4LG2R2NA  [L3518]
L2  2.2uH-DCR<0.1R-1.5A/ELL4LG2R2NA  [L3518]
L3  2.2uH-DCR<0.1R-1.5A/ELL4LG2R2NA  [L3518]
L4  2.2uH-DCR<0.1R-1.5A/ELL4LG2R2NA  [L3518]
L5  2.2uH-DCR<0.1R-1.5A/ELL4LG2R2NA  [L3518]
Q2  MMBT3904  [SOT-23]
R6  NC/0R  [R0201]
R7  0R03  [R0805]
R8  1R  [R0402]
R9  10K  [R0201]
R10  10K  [R0201]
R11  100K-1%  [R0402]
R12  442K-1%  [R0402]
R13  200K-1%  [R0201]
R14  47K  [R0201]
R15  1K  [R0201]
R16  100K-1%  [R0402]
R17  150K-1%  [R0402]
R18  47K  [R0201]
R19  2K  [R0201]
R20  1K  [R0201]
R21  1K  [R0201]
R22  2K2  [R0201]
TP4  SDA  [tp40_smd]
TP5  SCK  [tp40_smd]
TP6  DC3-SET  [tp40_smd]
U2  AXP209  [QFN49_0_4H0_8A]
U3  LP3220SAB5F\SY8088  [TSOT-23-6]
U4  LP3220SAB5F/SY8088  [TSOT-23-6]

### Nets
AVCC: C20.1 U2.12(LDO2) U4.1(EN)  [also labelled LDO2]
BAT: C4.2 C7.1 C27.2 ESD1.1(ANODE) R7.1 U2.38(BAT1) U2.39(BAT2) U2.42(BATSENSE)
CHG-IN: R8.2 U2.32(ACIN1) U2.33(ACIN2)
COREVDD: C14.1 C15.1 L3.1 U2.17(DCDC3)  [also labelled DCDC3]  [project net CORE-VDD]
CPUVDD: C10.1 C11.1 L2.1 U2.10(DCDC2)  [also labelled DCDC2]  [project net CPU-VDD]
DRAM-VCC: C31.1 C35.1 C36.1 L5.1 R17.2
GND: C5.2 C6.2 C7.2 C8.1 C9.2 C10.2 C11.2 C12.2 C13.2 C14.2 C15.2 C17.2 C18.2 C19.1 C20.2 C21.2 C22.2 C23.1 C24.2 C25.1 C26.2 C27.1 C28.2 C29.2 C30.1 C32.1 C33.2 C34.1 C35.2 C36.2 C37.1 D2.2(CATHODE) ESD1.2(CATHODE) Q2.2(E) R6.1 R11.1 R13.1 R16.1 R19.2 U2.9(PGND2) U2.16(PGND3) U2.22(AGND) U2.46(PGND1) U2.49(THERMAL) U3.2(GND) U4.2(GND)
IPSOUT: C5.1 C8.2 C9.1 C17.1 C21.1 C26.1 C28.1 C33.1 U2.7(VIN2) U2.13(LDO24IN) U2.14(VIN3) U2.21(APS) U2.34(PS1) U2.35(PS2) U2.40(LDO3IN) U2.44(VIN1) U3.4(IN) U4.4(IN)
LDO1: C19.2 R14.2 U2.28(LDO1)  [also labelled RTCVDD]
LDO3: C25.2 C30.2 U2.11(LDO4) U2.41(LDO3)  [also labelled LDO4]
LDO5: C29.1 U2.19(GPIO0/LDO)  [also labelled VCC-1V8]
USBVBUS: C13.1 U2.31(VBUS)
VBAT-EXT: C4.1 C6.1 L1.1 R7.2 U2.43(CHSENSE)
VCC-3V3: C16.1 C22.1 C24.1 D1.1(ANODE) L4.1 R9.2 R10.2 R12.2 R18.2 R21.2  [project net HPVCC]
AP-WAKE-BT: R10.1 U2.3(GPIO3) ; off-sheet AP-WAKE-BT
EXTEN: U2.20(EXTEN) U3.1(EN)
LED-STATUS: R9.1 R22.2 U2.5(GPIO2)
NMI-N: R14.1 U2.48(IRQ) ; off-sheet NMI-N  [project net NMI]
POWER-ON: R15.2 ; off-sheet POWER-ON
RESET-N: C34.2 R18.1 U2.25(PWROK) ; off-sheet RESET-N  [project net RESET]
TS: R6.2 U2.37(TS) ; off-sheet TS
TWI0-SCK: TP5.1(TP) U2.2(SCK) ; off-sheet TWI0-SCK  [project net PB0]
TWI0-SDA: TP4.1(TP) U2.1(SDA) ; off-sheet TWI0-SDA  [project net PB1]
USB0-DRV: U2.6(N_VBUSEN) ; off-sheet USB0-DRV  [project net PB11]
VINT: C18.1 U2.26(VINT) U2.27(LDO1SET)
NetC12_1: C12.1 R8.1
NetC16_2: C16.2 R11.2 R12.1 U3.5(FB)
NetC23_2: C23.2 U2.24(VREF)
NetC31_2: C31.2 R16.2 R17.1 U4.5(FB)
NetC32_2: C32.2 R15.1 U2.47(PWRON)
NetC37_2: C37.2 Q2.1(B) R22.1
NetD1_2: D1.2(CATHODE) R20.1
NetD2_1: D2.1(ANODE) R21.1
NetL1_2: L1.2 U2.45(LX1)
NetL2_2: L2.2 U2.8(LX2)
NetL3_2: L3.2 U2.15(LX3)
NetL4_2: L4.2 U3.3(LX)
NetL5_2: L5.2 U4.3(LX)
NetQ2_3: Q2.3(C) R20.2
NetR13_2: R13.2 U2.23(BIAS)
NetR19_1: R19.1 U2.4(N_OE)
NetTP6_1: TP6.1(TP) U2.29(DC3SET)

Not connected (* = marked no-connect by the designer): U2 18(GPIO1) 30(BACKUP) 36(CHGLED/GPO)

### Notes on the sheet
- POWER/PMU
- MAX
- 1200MA
- 200MA
- 1600MA
- (near C5) ¿¿½üVIN1·ÅÖÃ
  close to the VIN1 pin
- NC/50MA
- 1000MA
- IPSOUT TO 3V3
- (near R11) B
- A
- BATTERY IN
- Vout = 0.6*(1+RA/RB)
- (near C28) ¿¿½üLDO3IN·ÅÖÃ
  close to the LDO3IN pin
- IPSOUT TO 1V6
- (near R16) B
- (in symbol TitleBlock1-nextthing) Oakland, California; Design Name; docs.nextthing.co /; Size; Page Name; Rev; Date:; Sheet; of

### Library data of the parts
C4-C10 C12-C14 C17-C20 C23 C25 C26 C28-C30 C32 C34 = CAPACITOR_0_Dup2: PAGE: 1
C11 C15 = CAPACITOR_1: PAGE: 1
C16 C21 C22 C24 C31 C33 C35 C36 = CAPACITOR_0_Dup1: PAGE: 1
C27 = CAPACITOR_0_Dup4: PAGE: 1
C37 = CAPACITOR_0_Dup4: ROOM: MODEM; PAGE: 3
D1 = LED_0: PAGE: 1; ROOM: MODEM
D2 = LED_0: PAGE: 1
ESD1 = 1_1.5KE100A: as ESD2 on sheet 07 USB
L1-L3 = INDUCTOR_1
L4 L5 = INDUCTOR_0
Q2 = NPN: ROOM: MODEM
R6 R8-R10 R13-R15 R18 R19 R21 = R_Dup1
R7 = R: PAGE: 1
R11 R12 R16 R17 = ?_0
R20 R22 = RESISTOR: ROOM: MODEM
TP4 TP5 = T_POINT_R
TP6 = T_POINT_R_Dup1
U2 = AW1612_0
U3 U4 = RT9293B_0
*#6 = TitleBlock1-nextthing: Page Create Date: March  8, 1995

## Sheet 03 CPU.SchDoc
size 420 x 297 mm
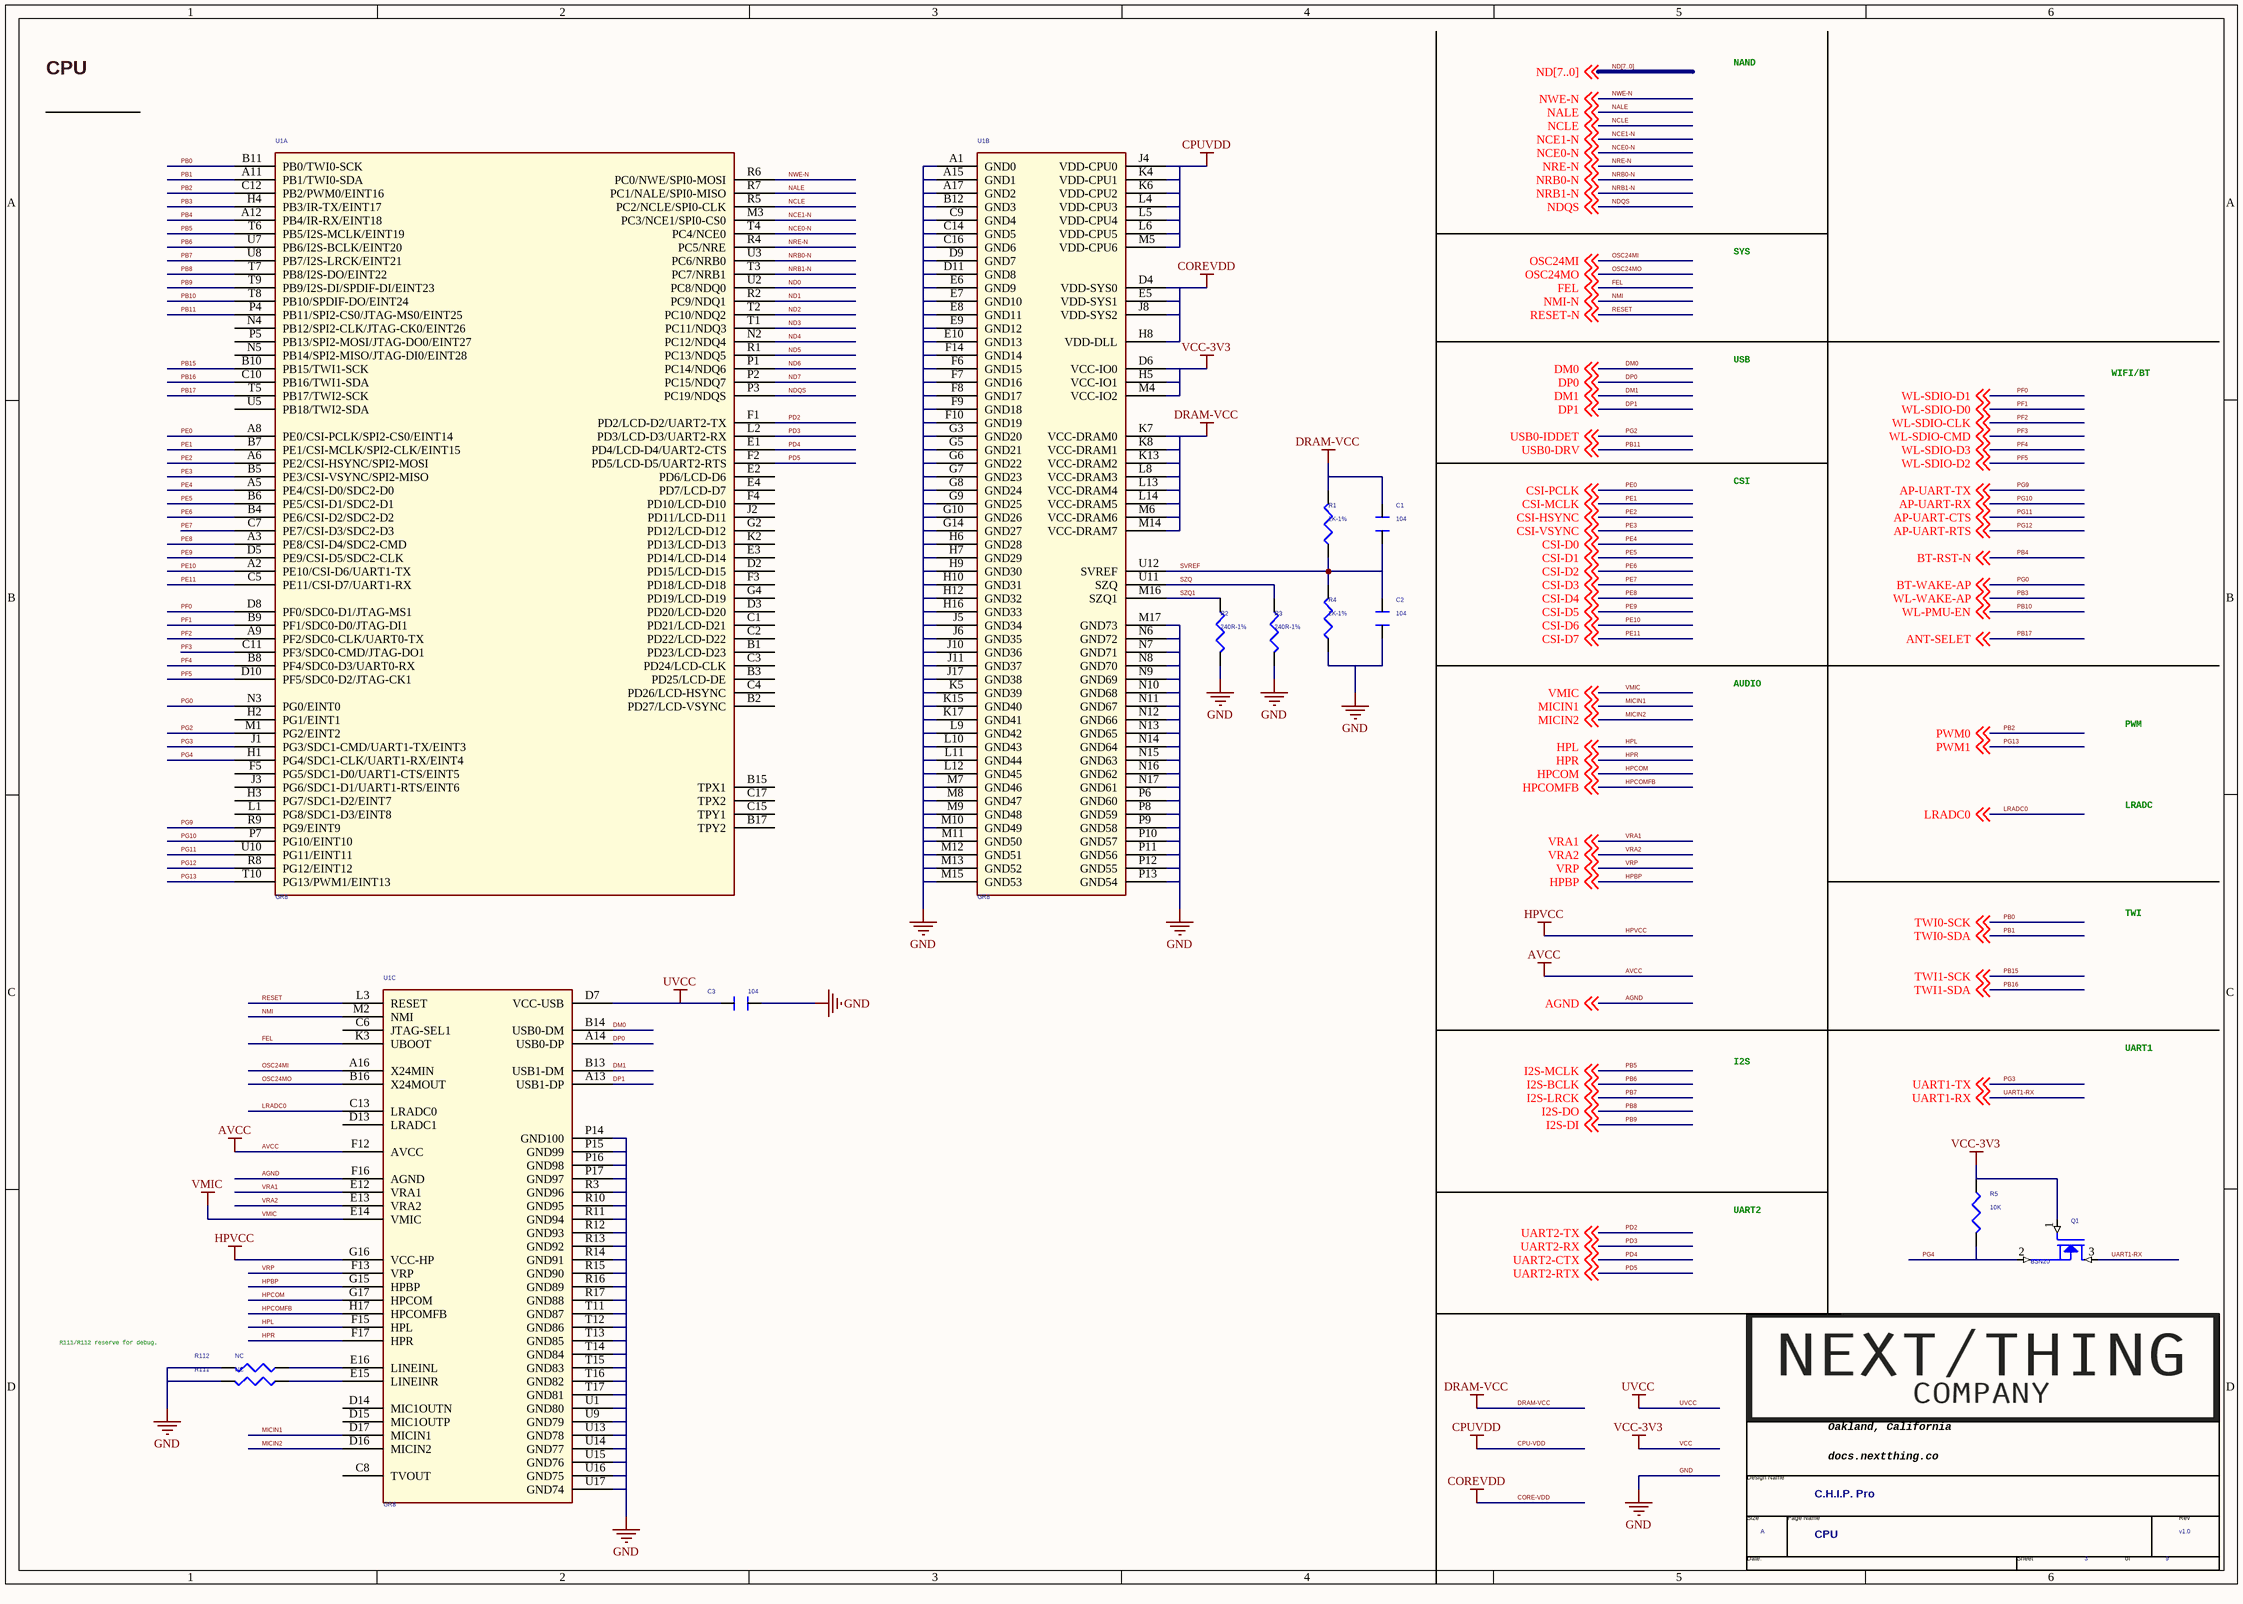
[diagram p6: 03 CPU.SchDoc]

### Parts
(Parts that share a designator on the sheet are numbered #1, #2 ... from top to bottom, then left to right.)
*#7  Page Count: 9  Page Number: 3  Page Size: A  Title: C.H.I.P. Pro  RevCode: v1.0  Doc: CPU  (hidden comment: TitleBlock1-nextthing)  (graphical)
C1  104  [0805]
C2  104  [0805]
C3  104  [C0201]
Q1  BSN20  [sot-23]
R1  2K-1%  [0805]
R2  240R-1%  [R0201]
R3  240R-1%  [R0201]
R4  2K-1%  [0805]
R5  10K  [0805]
R111  NC  [R0603]
R112  NC  [R0603]
U1  GR8  [BGA252P80B1400_1400]  (parts A,B,C of 3)

### Nets
AGND: U1.F16(AGND) ; off-sheet AGND
AVCC: U1.F12(AVCC)
CORE-VDD: U1.D4(VDD-SYS0) U1.E5(VDD-SYS1) U1.H8(VDD-DLL) U1.J8(VDD-SYS2)  [also labelled COREVDD]
CPU-VDD: U1.J4(VDD-CPU0) U1.K4(VDD-CPU1) U1.K6(VDD-CPU2) U1.L4(VDD-CPU3) U1.L5(VDD-CPU4) U1.L6(VDD-CPU5) U1.M5(VDD-CPU6)  [also labelled CPUVDD]
DRAM-VCC: C1.1 R1.2 U1.K7(VCC-DRAM0) U1.K8(VCC-DRAM1) U1.K13(VCC-DRAM2) U1.L8(VCC-DRAM3) U1.L13(VCC-DRAM4) U1.L14(VCC-DRAM5) U1.M6(VCC-DRAM6) U1.M14(VCC-DRAM7)
GND: C2.2 C3.1 R2.1 R3.1 R4.1 R111.2 R112.1 U1.A1(GND0) U1.A15(GND1) U1.A17(GND2) U1.B12(GND3) U1.C9(GND4) U1.C14(GND5) U1.C16(GND6) U1.D9(GND7) U1.D11(GND8) U1.E6(GND9) U1.E7(GND10) U1.E8(GND11) U1.E9(GND12) U1.E10(GND13) U1.F6(GND15) U1.F7(GND16) U1.F8(GND17) U1.F9(GND18) U1.F10(GND19) U1.F14(GND14) U1.G3(GND20) U1.G5(GND21) U1.G6(GND22) U1.G7(GND23) U1.G8(GND24) U1.G9(GND25) U1.G10(GND26) U1.G14(GND27) U1.H6(GND28) U1.H7(GND29) U1.H9(GND30) U1.H10(GND31) U1.H12(GND32) U1.H16(GND33) U1.J5(GND34) U1.J6(GND35) U1.J10(GND36) U1.J11(GND37) U1.J17(GND38) U1.K5(GND39) U1.K15(GND40) U1.K17(GND41) U1.L9(GND42) U1.L10(GND43) U1.L11(GND44) U1.L12(GND45) U1.M7(GND46) U1.M8(GND47) U1.M9(GND48) U1.M10(GND49) U1.M11(GND50) U1.M12(GND51) U1.M13(GND52) U1.M15(GND53) U1.M17(GND73) U1.N6(GND72) U1.N7(GND71) U1.N8(GND70) U1.N9(GND69) U1.N10(GND68) U1.N11(GND67) U1.N12(GND66) U1.N13(GND65) U1.N14(GND64) U1.N15(GND63) U1.N16(GND62) U1.N17(GND61) U1.P6(GND60) U1.P8(GND59) U1.P9(GND58) U1.P10(GND57) U1.P11(GND56) U1.P12(GND55) U1.P13(GND54) U1.P14(GND100) U1.P15(GND99) U1.P16(GND98) U1.P17(GND97) U1.R3(GND96) U1.R10(GND95) U1.R11(GND94) U1.R12(GND93) U1.R13(GND92) U1.R14(GND91) U1.R15(GND90) U1.R16(GND89) U1.R17(GND88) U1.T11(GND87) U1.T12(GND86) U1.T13(GND85) U1.T14(GND84) U1.T15(GND83) U1.T16(GND82) U1.T17(GND81) U1.U1(GND80) U1.U9(GND79) U1.U13(GND78) U1.U14(GND77) U1.U15(GND76) U1.U16(GND75) U1.U17(GND74)
HPVCC: C3.2 Q1.1(GATE) R5.1 U1.D6(VCC-IO0) U1.D7(VCC-USB) U1.G16(VCC-HP) U1.H5(VCC-IO1) U1.M4(VCC-IO2)  [also labelled UVCC, VCC, VCC-3V3]
VMIC: U1.E14(VMIC) ; off-sheet VMIC
ANT-SELET: U1.T5(PB17/TWI2-SCK) ; off-sheet ANT-SELET  [also labelled PB17]
AP-UART-CTS: U1.U10(PG11/EINT11) ; off-sheet AP-UART-CTS  [also labelled PG11]  [project net BT-UART-RTS]
AP-UART-RTS: U1.R8(PG12/EINT12) ; off-sheet AP-UART-RTS  [also labelled PG12]  [project net BT-UART-CTS]
AP-UART-RX: U1.P7(PG10/EINT10) ; off-sheet AP-UART-RX  [also labelled PG10]  [project net BT-UART-TX]
AP-UART-TX: U1.R9(PG9/EINT9) ; off-sheet AP-UART-TX  [also labelled PG9]  [project net BT-UART-RX]
BT-RST-N: U1.A12(PB4/IR-RX/EINT18) ; off-sheet BT-RST-N  [also labelled PB4]
BT-WAKE-AP: U1.N3(PG0/EINT0) ; off-sheet BT-WAKE-AP  [also labelled PG0]
CSI-D0: U1.A5(PE4/CSI-D0/SDC2-D0) ; off-sheet CSI-D0  [also labelled PE4]  [project net CSID0]
CSI-D1: U1.B6(PE5/CSI-D1/SDC2-D1) ; off-sheet CSI-D1  [also labelled PE5]  [project net CSID1]
CSI-D2: U1.B4(PE6/CSI-D2/SDC2-D2) ; off-sheet CSI-D2  [also labelled PE6]  [project net CSID2]
CSI-D3: U1.C7(PE7/CSI-D3/SDC2-D3) ; off-sheet CSI-D3  [also labelled PE7]  [project net CSID3]
CSI-D4: U1.A3(PE8/CSI-D4/SDC2-CMD) ; off-sheet CSI-D4  [also labelled PE8]  [project net CSID4]
CSI-D5: U1.D5(PE9/CSI-D5/SDC2-CLK) ; off-sheet CSI-D5  [also labelled PE9]  [project net CSID5]
CSI-D6: U1.A2(PE10/CSI-D6/UART1-TX) ; off-sheet CSI-D6  [also labelled PE10]  [project net CSID6]
CSI-D7: U1.C5(PE11/CSI-D7/UART1-RX) ; off-sheet CSI-D7  [also labelled PE11]  [project net CSID7]
CSI-HSYNC: U1.A6(PE2/CSI-HSYNC/SPI2-MOSI) ; off-sheet CSI-HSYNC  [also labelled PE2]  [project net CSIHSYNC]
CSI-MCLK: U1.B7(PE1/CSI-MCLK/SPI2-CLK/EINT15) ; off-sheet CSI-MCLK  [also labelled PE1]  [project net CSIMCLK]
CSI-PCLK: U1.A8(PE0/CSI-PCLK/SPI2-CS0/EINT14) ; off-sheet CSI-PCLK  [also labelled PE0]  [project net CSIPCLK]
CSI-VSYNC: U1.B5(PE3/CSI-VSYNC/SPI2-MISO) ; off-sheet CSI-VSYNC  [also labelled PE3]  [project net CSIVSYNC]
DM0: U1.B14(USB0-DM) ; off-sheet DM0
DM1: U1.B13(USB1-DM) ; off-sheet DM1
DP0: U1.A14(USB0-DP) ; off-sheet DP0
DP1: U1.A13(USB1-DP) ; off-sheet DP1
FEL: U1.K3(UBOOT) ; off-sheet FEL
HPBP: U1.G15(HPBP) ; off-sheet HPBP
HPCOM: U1.G17(HPCOM) U1.H17(HPCOMFB) ; off-sheet HPCOM, off-sheet HPCOMFB  [also labelled HPCOMFB]
HPL: U1.F15(HPL) ; off-sheet HPL
HPR: U1.F17(HPR) ; off-sheet HPR
I2S-BCLK: U1.U7(PB6/I2S-BCLK/EINT20) ; off-sheet I2S-BCLK  [also labelled PB6]
I2S-DI: U1.T9(PB9/I2S-DI/SPDIF-DI/EINT23) ; off-sheet I2S-DI  [also labelled PB9]
I2S-DO: U1.T7(PB8/I2S-DO/EINT22) ; off-sheet I2S-DO  [also labelled PB8]
I2S-LRCK: U1.U8(PB7/I2S-LRCK/EINT21) ; off-sheet I2S-LRCK  [also labelled PB7]
I2S-MCLK: U1.T6(PB5/I2S-MCLK/EINT19) ; off-sheet I2S-MCLK  [also labelled PB5]
LRADC0: U1.C13(LRADC0) ; off-sheet LRADC0
MICIN1: U1.D17(MICIN1) ; off-sheet MICIN1
MICIN2: U1.D16(MICIN2) ; off-sheet MICIN2
NALE: U1.R7(PC1/NALE/SPI0-MISO) ; off-sheet NALE
NCE0-N: U1.T4(PC4/NCE0) ; off-sheet NCE0-N
NCE1-N: U1.M3(PC3/NCE1/SPI0-CS0) ; off-sheet NCE1-N
NCLE: U1.R5(PC2/NCLE/SPI0-CLK) ; off-sheet NCLE
ND0: U1.U2(PC8/NDQ0)
ND1: U1.R2(PC9/NDQ1)
ND2: U1.T2(PC10/NDQ2)
ND3: U1.T1(PC11/NDQ3)
ND4: U1.N2(PC12/NDQ4)
ND5: U1.R1(PC13/NDQ5)
ND6: U1.P1(PC14/NDQ6)
ND7: U1.P2(PC15/NDQ7)
NDQS: U1.P3(PC19/NDQS) ; off-sheet NDQS
NMI: U1.M2(NMI) ; off-sheet NMI-N  [also labelled NMI-N]
NRB0-N: U1.U3(PC6/NRB0) ; off-sheet NRB0-N
NRB1-N: U1.T3(PC7/NRB1) ; off-sheet NRB1-N
NRE-N: U1.R4(PC5/NRE) ; off-sheet NRE-N
NWE-N: U1.R6(PC0/NWE/SPI0-MOSI) ; off-sheet NWE-N
OSC24MI: U1.A16(X24MIN) ; off-sheet OSC24MI
OSC24MO: U1.B16(X24MOUT) ; off-sheet OSC24MO
PB0: U1.B11(PB0/TWI0-SCK) ; off-sheet TWI0-SCK  [also labelled TWI0-SCK]
PB1: U1.A11(PB1/TWI0-SDA) ; off-sheet TWI0-SDA  [also labelled TWI0-SDA]
PB2: U1.C12(PB2/PWM0/EINT16) ; off-sheet PWM0  [also labelled PWM0]
PB3: U1.H4(PB3/IR-TX/EINT17) ; off-sheet WL-WAKE-AP  [also labelled WL-WAKE-AP]
PB10: U1.T8(PB10/SPDIF-DO/EINT24) ; off-sheet WL-PMU-EN  [also labelled WL-PMU-EN]
PB11: U1.P4(PB11/SPI2-CS0/JTAG-MS0/EINT25) ; off-sheet USB0-DRV  [also labelled USB0-DRV]
PB15: U1.B10(PB15/TWI1-SCK) ; off-sheet TWI1-SCK  [also labelled TWI1-SCK]
PB16: U1.C10(PB16/TWI1-SDA) ; off-sheet TWI1-SDA  [also labelled TWI1-SDA]
PD2: U1.F1(PD2/LCD-D2/UART2-TX) ; off-sheet UART2-TX  [also labelled UART2-TX]
PD3: U1.L2(PD3/LCD-D3/UART2-RX) ; off-sheet UART2-RX  [also labelled UART2-RX]
PD4: U1.E1(PD4/LCD-D4/UART2-CTS) ; off-sheet UART2-CTX  [also labelled UART2-CTX]
PD5: U1.F2(PD5/LCD-D5/UART2-RTS) ; off-sheet UART2-RTX  [also labelled UART2-RTX]
PF0: U1.D8(PF0/SDC0-D1/JTAG-MS1) ; off-sheet WL-SDIO-D1  [also labelled WL-SDIO-D1]
PF1: U1.B9(PF1/SDC0-D0/JTAG-DI1) ; off-sheet WL-SDIO-D0  [also labelled WL-SDIO-D0]
PF2: U1.A9(PF2/SDC0-CLK/UART0-TX) ; off-sheet WL-SDIO-CLK  [also labelled WL-SDIO-CLK]
PF3: U1.C11(PF3/SDC0-CMD/JTAG-DO1) ; off-sheet WL-SDIO-CMD  [also labelled WL-SDIO-CMD]
PF4: U1.B8(PF4/SDC0-D3/UART0-RX) ; off-sheet WL-SDIO-D3  [also labelled WL-SDIO-D3]
PF5: U1.D10(PF5/SDC0-D2/JTAG-CK1) ; off-sheet WL-SDIO-D2  [also labelled WL-SDIO-D2]
PG2: U1.M1(PG2/EINT2) ; off-sheet USB0-IDDET  [also labelled USB0-IDDET]
PG3: U1.J1(PG3/SDC1-CMD/UART1-TX/EINT3) ; off-sheet UART1-TX  [also labelled UART1-TX]
PG4: Q1.2(SOURCE) R5.2 U1.H1(PG4/SDC1-CLK/UART1-RX/EINT4)
PG13: U1.T10(PG13/PWM1/EINT13) ; off-sheet PWM1  [also labelled PWM1]
RESET: U1.L3(RESET) ; off-sheet RESET-N  [also labelled RESET-N]
SVREF: C1.2 C2.1 R1.1 R4.2 U1.U12(SVREF)
SZQ: R3.2 U1.U11(SZQ)
SZQ1: R2.2 U1.M16(SZQ1)
UART1-RX: Q1.3(DRAIN) ; off-sheet UART1-RX
VRA1: U1.E12(VRA1) ; off-sheet VRA1
VRA2: U1.E13(VRA2) ; off-sheet VRA2
VRP: U1.F13(VRP) ; off-sheet VRP
NetR111_1: R111.1 U1.E15(LINEINR)
NetR112_2: R112.2 U1.E16(LINEINL)

Not connected (* = marked no-connect by the designer): U1 B1(PD23/LCD-D23) B2(PD27/LCD-VSYNC) B3(PD25/LCD-DE) B15(TPX1) B17(TPY2) C1(PD21/LCD-D21) C2(PD22/LCD-D22) C3(PD24/LCD-CLK) C4(PD26/LCD-HSYNC) C6(JTAG-SEL1) C8(TVOUT) C15(TPY1) C17(TPX2) D2(PD15/LCD-D15) D3(PD20/LCD-D20) D13(LRADC1) D14(MIC1OUTN) D15(MIC1OUTP) E2(PD6/LCD-D6) E3(PD14/LCD-D14) E4(PD7/LCD-D7) F3(PD18/LCD-D18) F4(PD10/LCD-D10) F5(PG5/SDC1-D0/UART1-CTS/EINT5) G2(PD12/LCD-D12) G4(PD19/LCD-D19) H2(PG1/EINT1) H3(PG7/SDC1-D2/EINT7) J2(PD11/LCD-D11) J3(PG6/SDC1-D1/UART1-RTS/EINT6) K2(PD13/LCD-D13) L1(PG8/SDC1-D3/EINT8) N4(PB12/SPI2-CLK/JTAG-CK0/EINT26) N5(PB14/SPI2-MISO/JTAG-DI0/EINT28) P5(PB13/SPI2-MOSI/JTAG-DO0/EINT27) U5(PB18/TWI2-SDA)

### Buses and harness runs
bus ND[7..0]

### Notes on the sheet
- CPU
- NAND
- SYS
- USB
- WIFI/BT
- CSI
- AUDIO
- PWM
- LRADC
- TWI
- I2S
- UART1
- UART2
- R111/R112 reserve for debug.
- (in symbol TitleBlock1-nextthing) Oakland, California; Design Name; docs.nextthing.co /; Size; Page Name; Rev; Date:; Sheet; of

### Library data of the parts
C1 C2 = CAP_0
C3 = CAPACITOR_0_Dup4: PAGE: 3
Q1 = NMOS_xp151_SOT23
R1 R4 = R1 0805
R2 R3 = R_Dup2
R5 = R1_0805: ROOM: DRAM
R111 R112 = RESISTOR_0
U1 = GR8_BGA252: SPLIT_INST: TRUE
*#7 = TitleBlock1-nextthing: Page Create Date: March  8, 1995

## Sheet 02 BLOCK.SchDoc
size 420 x 297 mm
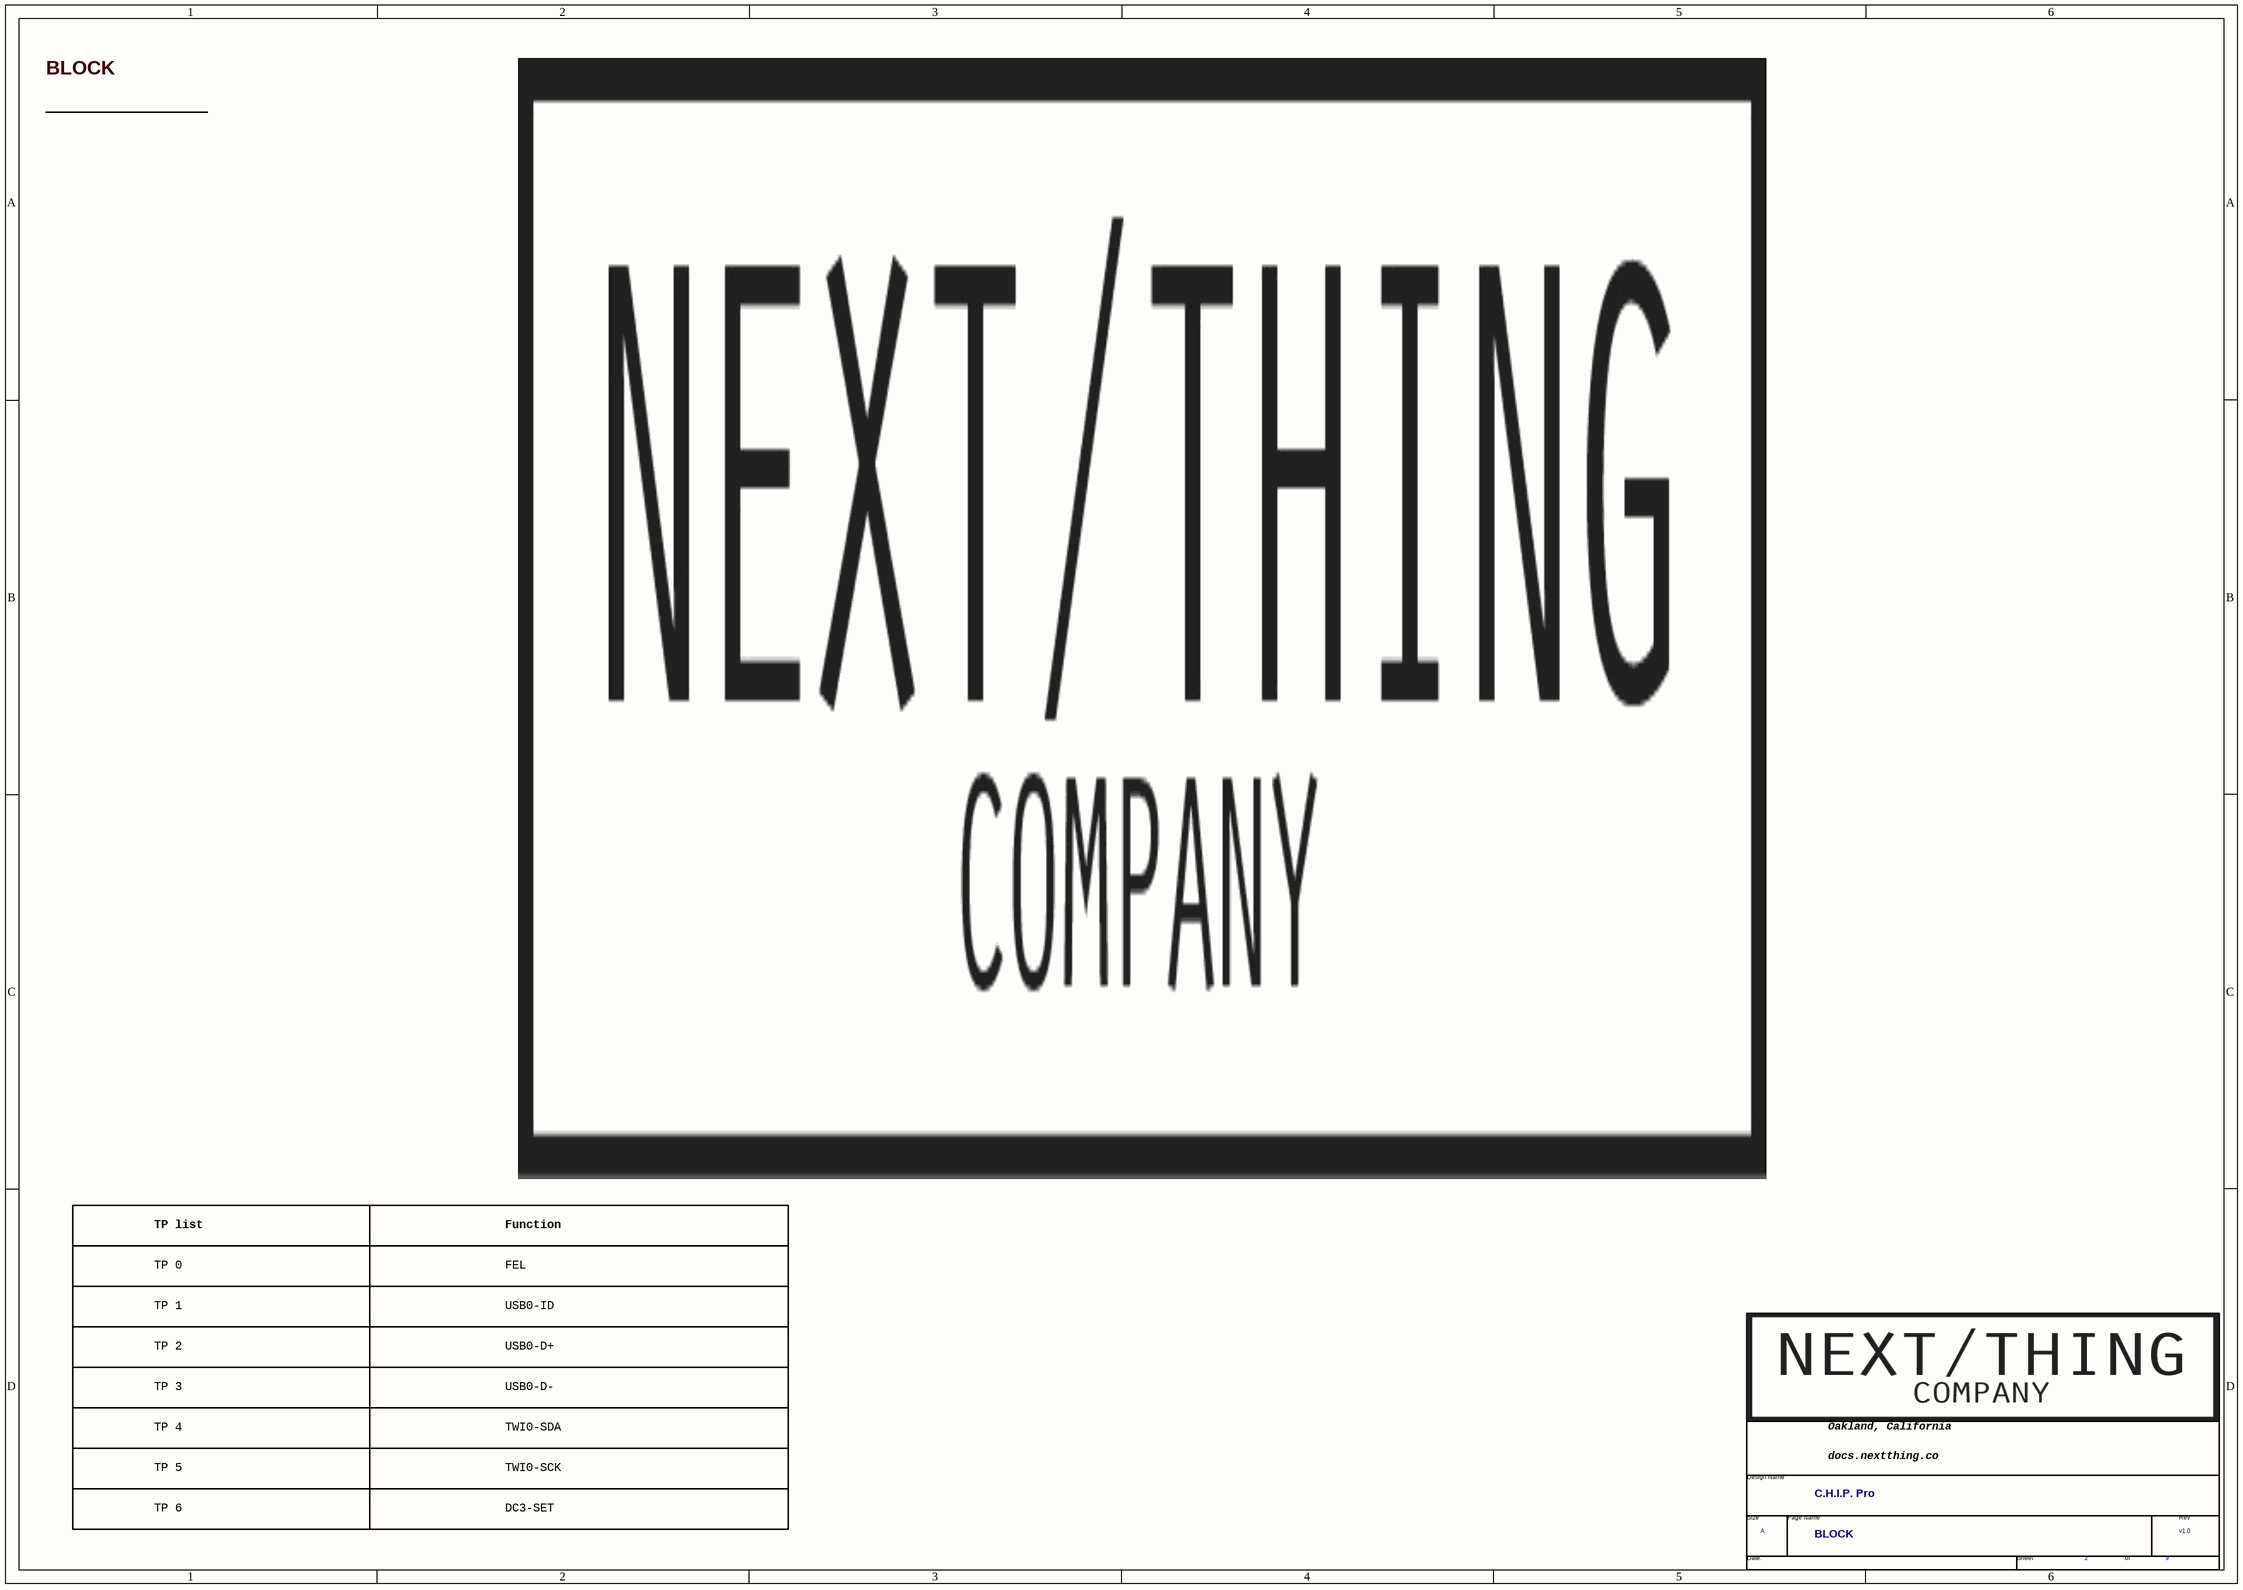
[diagram p7: 02 BLOCK.SchDoc]

### Parts
(Parts that share a designator on the sheet are numbered #1, #2 ... from top to bottom, then left to right.)
*#8  Page Count: 9  Page Number: 2  Page Size: A  Title: C.H.I.P. Pro  RevCode: v1.0  Doc: BLOCK  (hidden comment: TitleBlock1-nextthing)  (graphical)

### Notes on the sheet
- BLOCK
- TP list
- TP 0
- Function
- FEL
- TP 1
- USB0-ID
- TP 2
- TP 3
- USB0-D+
- USB0-D-
- TP 4
- TP 5
- TWI0-SDA
- TWI0-SCK
- TP 6
- DC3-SET
- (in symbol TitleBlock1-nextthing) Oakland, California; Design Name; docs.nextthing.co /; Size; Page Name; Rev; Date:; Sheet; of

### Library data of the parts
*#8 = TitleBlock1-nextthing: Page Create Date: March  8, 1995

## Sheet 01 REVISION HISTORY.SchDoc
size 420 x 297 mm
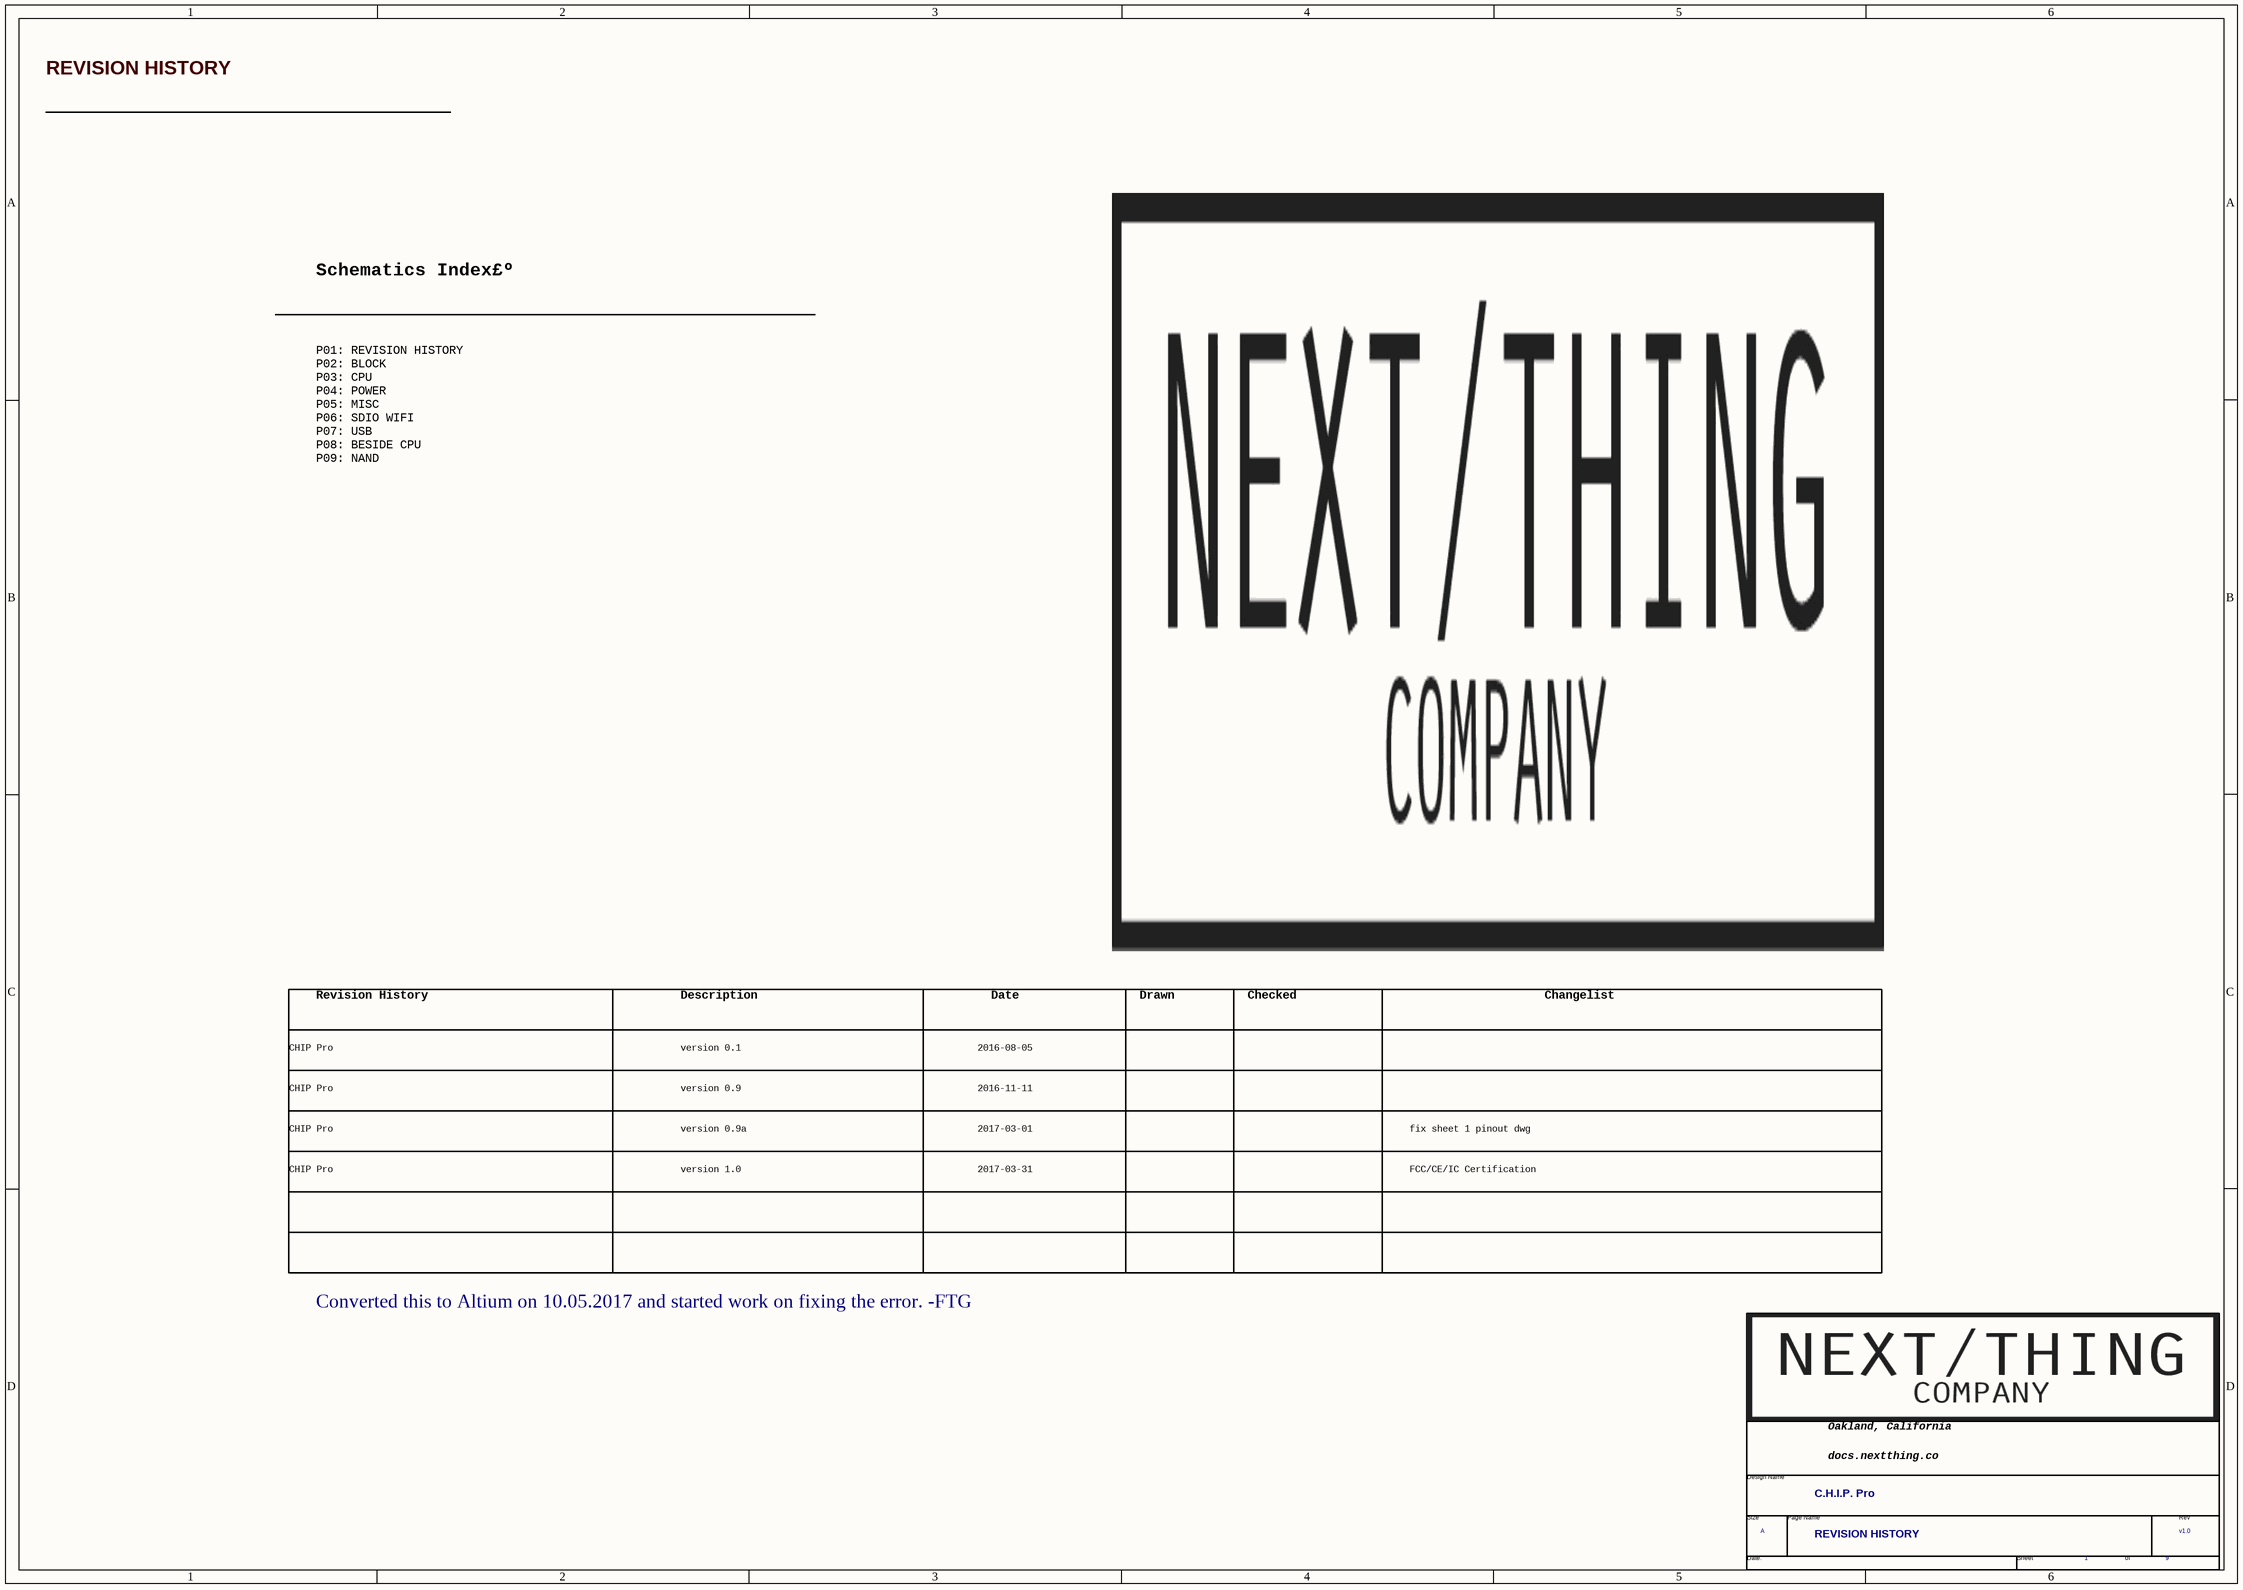
[diagram p8: 01 REVISION HISTORY.SchDoc]

### Parts
(Parts that share a designator on the sheet are numbered #1, #2 ... from top to bottom, then left to right.)
*#9  Page Count: 9  Page Number: 1  Page Size: A  Title: C.H.I.P. Pro  RevCode: v1.0  Doc: REVISION HISTORY  (hidden comment: TitleBlock1-nextthing)  (graphical)

### Notes on the sheet
- REVISION HISTORY
- Schematics Index£º
- P01: REVISION HISTORY
  P02: BLOCK
  P03: CPU
  P04: POWER
  P05: MISC
  P06: SDIO WIFI
  P07: USB
  P08: BESIDE CPU
  P09: NAND
- Revision History
- Description
- Date
- Drawn
- Checked
- Changelist
- CHIP Pro
- version 0.1
- 2016-08-05
- version 0.9
- version 0.9a
- 2016-11-11
- 2017-03-01
- fix sheet 1 pinout dwg
- version 1.0
- 2017-03-31
- FCC/CE/IC Certification
- Converted this to Altium on 10.05.2017 and started work on fixing the error. -FTG
- (in symbol TitleBlock1-nextthing) Oakland, California; Design Name; docs.nextthing.co /; Size; Page Name; Rev; Date:; Sheet; of

### Library data of the parts
*#9 = TitleBlock1-nextthing: Page Create Date: March  8, 1995

## Nets that join several sheets
AGND: 08 BESIDE CPU (9 pins), 05 MISC (C148.2 C151.2 J3.10), 03 CPU (U1.F16)
AVCC: 04 POWER (C20.1 U2.12 U4.1), 03 CPU (U1.F12)
BAT: 05 MISC (J1.8 J1.24), 04 POWER (8 pins)
CHG-IN: 05 MISC (J1.4 J1.20), 04 POWER (R8.2 U2.32 U2.33)
CORE-VDD: 08 BESIDE CPU (6 pins), 04 POWER (C14.1 C15.1 L3.1 U2.17), 03 CPU (U1.D4 U1.E5 U1.H8 U1.J8)
CPU-VDD: 08 BESIDE CPU (9 pins), 04 POWER (C10.1 C11.1 L2.1 U2.10), 03 CPU (7 pins)
DRAM-VCC: 08 BESIDE CPU (5 pins), 04 POWER (5 pins), 03 CPU (10 pins)
GND: 09 NAND (13 pins), 08 BESIDE CPU (34 pins), 07 USB (16 pins), 06 SDIO WIFI&BT (19 pins), 05 MISC (J3.1 SW2.2), 04 POWER (46 pins), 03 CPU (108 pins)
HPVCC: 09 NAND (15 pins), 08 BESIDE CPU (11 pins), 07 USB (R51.2), 06 SDIO WIFI&BT (17 pins), 05 MISC (J1.2 J1.18), 04 POWER (10 pins), 03 CPU (8 pins)
IPSOUT: 05 MISC (J1.3 J1.19), 04 POWER (18 pins)
LDO3: 06 SDIO WIFI&BT (R32.2), 04 POWER (C25.2 C30.2 U2.11 U2.41)
USBVBUS: 07 USB (5 pins), 04 POWER (C13.1 U2.31)
VBAT-EXT: 06 SDIO WIFI&BT (R31.2), 04 POWER (5 pins)
VMIC: 05 MISC (J3.13), 03 CPU (U1.E14)
ANT-SELET: 06 SDIO WIFI&BT (C152.2 U8.5), 03 CPU (U1.T5)
AP-WAKE-BT: 06 SDIO WIFI&BT (U5.6), 04 POWER (R10.1 U2.3)
BT-RST-N: 06 SDIO WIFI&BT (R48.1 U5.34), 03 CPU (U1.A12)
BT-UART-CTS: 06 SDIO WIFI&BT (R44.2 U5.44), 03 CPU (U1.R8)
BT-UART-RTS: 06 SDIO WIFI&BT (R45.2 U5.41), 03 CPU (U1.U10)
BT-UART-RX: 06 SDIO WIFI&BT (R47.2 U5.43), 03 CPU (U1.R9)
BT-UART-TX: 06 SDIO WIFI&BT (R46.2 U5.42), 03 CPU (U1.P7)
BT-WAKE-AP: 06 SDIO WIFI&BT (R37.2), 03 CPU (U1.N3)
CSID0: 05 MISC (J2.8 J2.24), 03 CPU (U1.A5)
CSID1: 05 MISC (J2.7 J2.23), 03 CPU (U1.B6)
CSID2: 05 MISC (J2.6 J2.22), 03 CPU (U1.B4)
CSID3: 05 MISC (J2.5 J2.21), 03 CPU (U1.C7)
CSID4: 05 MISC (J2.4 J2.20), 03 CPU (U1.A3)
CSID5: 05 MISC (J2.3 J2.19), 03 CPU (U1.D5)
CSID6: 05 MISC (J2.2 J2.18), 03 CPU (U1.A2)
CSID7: 05 MISC (J2.1 J2.17), 03 CPU (U1.C5)
CSIHSYNC: 05 MISC (J2.10 J2.26), 03 CPU (U1.A6)
CSIMCLK: 05 MISC (J2.11 J2.27), 03 CPU (U1.B7)
CSIPCLK: 05 MISC (J2.12 J2.28), 03 CPU (U1.A8)
CSIVSYNC: 05 MISC (J2.9 J2.25), 03 CPU (U1.B5)
DM0: 07 USB (L9.2), 03 CPU (U1.B14)
DM1: 07 USB (L10.1), 03 CPU (U1.B13)
DP0: 07 USB (L9.1), 03 CPU (U1.A14)
DP1: 07 USB (L10.2), 03 CPU (U1.A13)
FEL: 05 MISC (SW2.1 TP0.1), 03 CPU (U1.K3)
HPBP: 08 BESIDE CPU (C92.2 C93.2), 03 CPU (U1.G15)
HPCOM: 05 MISC (J3.3), 03 CPU (U1.G17 U1.H17)
HPL: 05 MISC (C44.1 R101.1), 03 CPU (U1.F15)
HPR: 05 MISC (C45.1 R100.1), 03 CPU (U1.F17)
I2S-BCLK: 05 MISC (J3.6), 03 CPU (U1.U7)
I2S-DI: 05 MISC (J3.9), 03 CPU (U1.T9)
I2S-DO: 05 MISC (J3.8), 03 CPU (U1.T7)
I2S-LRCK: 05 MISC (J3.7), 03 CPU (U1.U8)
I2S-MCLK: 05 MISC (J3.5), 03 CPU (U1.T6)
LRADC0: 08 BESIDE CPU (C84.2), 05 MISC (J2.13 J2.29), 03 CPU (U1.C13)
MICIN1: 05 MISC (J3.11), 03 CPU (U1.D17)
MICIN2: 05 MISC (J3.12), 03 CPU (U1.D16)
NALE: 09 NAND (U6.7 U7.17), 03 CPU (U1.R7)
NCE0-N: 09 NAND (U6.4 U7.9), 03 CPU (U1.T4)
NCE1-N: 09 NAND (U7.10), 03 CPU (U1.M3)
NCLE: 09 NAND (U6.6 U7.16), 03 CPU (U1.R5)
ND0: 09 NAND (U6.11 U7.29), 03 CPU (U1.U2)
ND1: 09 NAND (U6.12 U7.30), 03 CPU (U1.R2)
ND2: 09 NAND (U6.13 U7.31), 03 CPU (U1.T2)
ND3: 09 NAND (U6.14 U7.32), 03 CPU (U1.T1)
ND4: 09 NAND (U6.16 U7.41), 03 CPU (U1.N2)
ND5: 09 NAND (U6.17 U7.42), 03 CPU (U1.R1)
ND6: 09 NAND (U6.18 U7.43), 03 CPU (U1.P1)
ND7: 09 NAND (U6.19 U7.44), 03 CPU (U1.P2)
NDQS: 09 NAND (U7.35), 03 CPU (U1.P3)
NMI: 04 POWER (R14.1 U2.48), 03 CPU (U1.M2)
NRB0-N: 09 NAND (R64.2 U6.2 U7.7), 03 CPU (U1.U3)
NRB1-N: 09 NAND (R63.2 U7.6), 03 CPU (U1.T3)
NRE-N: 09 NAND (U6.3 U7.8), 03 CPU (U1.R4)
NWE-N: 09 NAND (U6.8 U7.18), 03 CPU (U1.R6)
OSC24MI: 08 BESIDE CPU (C67.2 X1.1), 03 CPU (U1.A16)
OSC24MO: 08 BESIDE CPU (C73.2 X1.3), 03 CPU (U1.B16)
PB0: 08 BESIDE CPU (R60.2), 04 POWER (TP5.1 U2.2), 03 CPU (U1.B11)
PB1: 08 BESIDE CPU (R59.2), 04 POWER (TP4.1 U2.1), 03 CPU (U1.A11)
PB2: 05 MISC (J1.9 J1.25), 03 CPU (U1.C12)
PB3: 06 SDIO WIFI&BT (R50.2), 03 CPU (U1.H4)
PB10: 06 SDIO WIFI&BT (R49.1 U5.12), 03 CPU (U1.T8)
PB11: 04 POWER (U2.6), 03 CPU (U1.P4)
PB15: 08 BESIDE CPU (R62.2), 05 MISC (J1.11 J1.27), 03 CPU (U1.B10)
PB16: 08 BESIDE CPU (R61.2), 05 MISC (J1.12 J1.28), 03 CPU (U1.C10)
PD2: 05 MISC (J1.13 J1.29), 03 CPU (U1.F1)
PD3: 05 MISC (J1.14 J1.30), 03 CPU (U1.L2)
PD4: 05 MISC (J1.15 J1.31), 03 CPU (U1.E1)
PD5: 05 MISC (J1.16 J1.32), 03 CPU (U1.F2)
PF0: 06 SDIO WIFI&BT (R38.2 U5.19), 03 CPU (U1.D8)
PF1: 06 SDIO WIFI&BT (R39.2 U5.18), 03 CPU (U1.B9)
PF2: 06 SDIO WIFI&BT (R40.2 U5.17), 03 CPU (U1.A9)
PF3: 06 SDIO WIFI&BT (R41.2 U5.16), 03 CPU (U1.C11)
PF4: 06 SDIO WIFI&BT (R42.2 U5.15), 03 CPU (U1.B8)
PF5: 06 SDIO WIFI&BT (R43.2 U5.14), 03 CPU (U1.D10)
PG2: 07 USB (ESD2.1 J4.4 R51.1 TP1.1), 03 CPU (U1.M1)
PG3: 05 MISC (J2.15 J2.31), 03 CPU (U1.J1)
PG13: 05 MISC (J1.10 J1.26), 03 CPU (U1.T10)
POWER-ON: 05 MISC (J1.5 J1.21), 04 POWER (R15.2)
RESET: 08 BESIDE CPU (C86.2), 04 POWER (C34.2 R18.1 U2.25), 03 CPU (U1.L3)
TS: 05 MISC (J1.7 J1.23), 04 POWER (R6.2 U2.37)
UART1-RX: 05 MISC (J2.14 J2.30), 03 CPU (Q1.3)
VRA1: 08 BESIDE CPU (C74.2), 03 CPU (U1.E12)
VRA2: 08 BESIDE CPU (C89.2 C90.2 R57.2), 03 CPU (U1.E13)
VRP: 08 BESIDE CPU (C87.2 C88.2), 03 CPU (U1.F13)